# EAGLE design TPadTabletBattery (EAGLE 6.5.0)
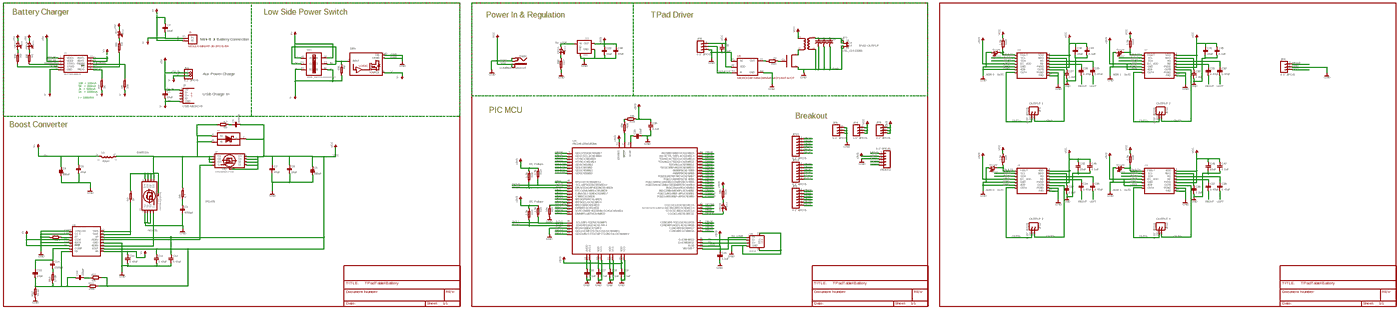
[diagram p0: schematic, sheet 1, overview]
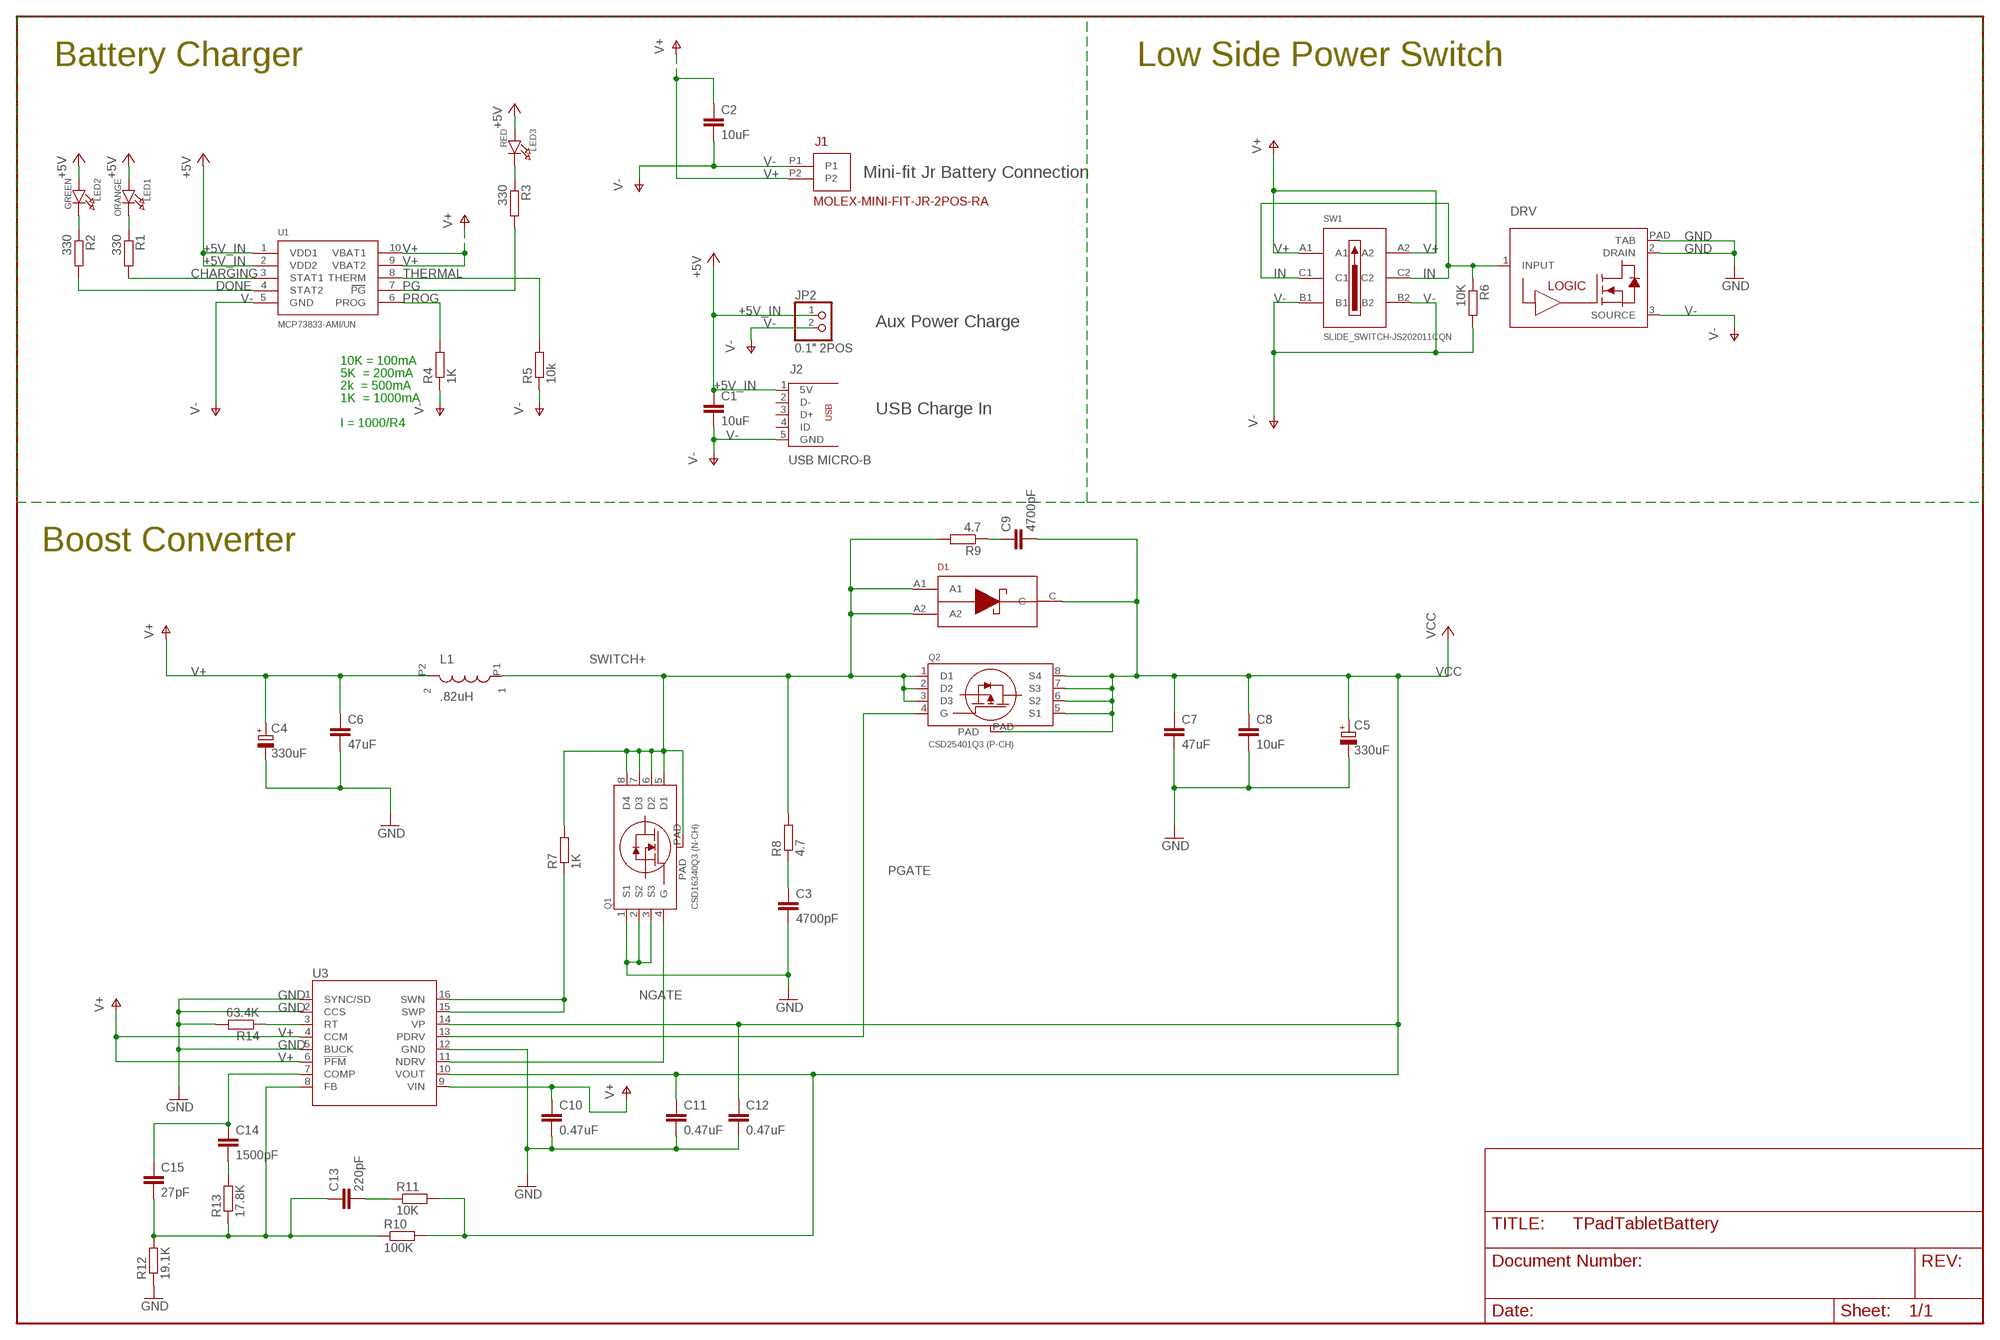
[diagram p1: schematic, sheet 1, part 1 of 4]
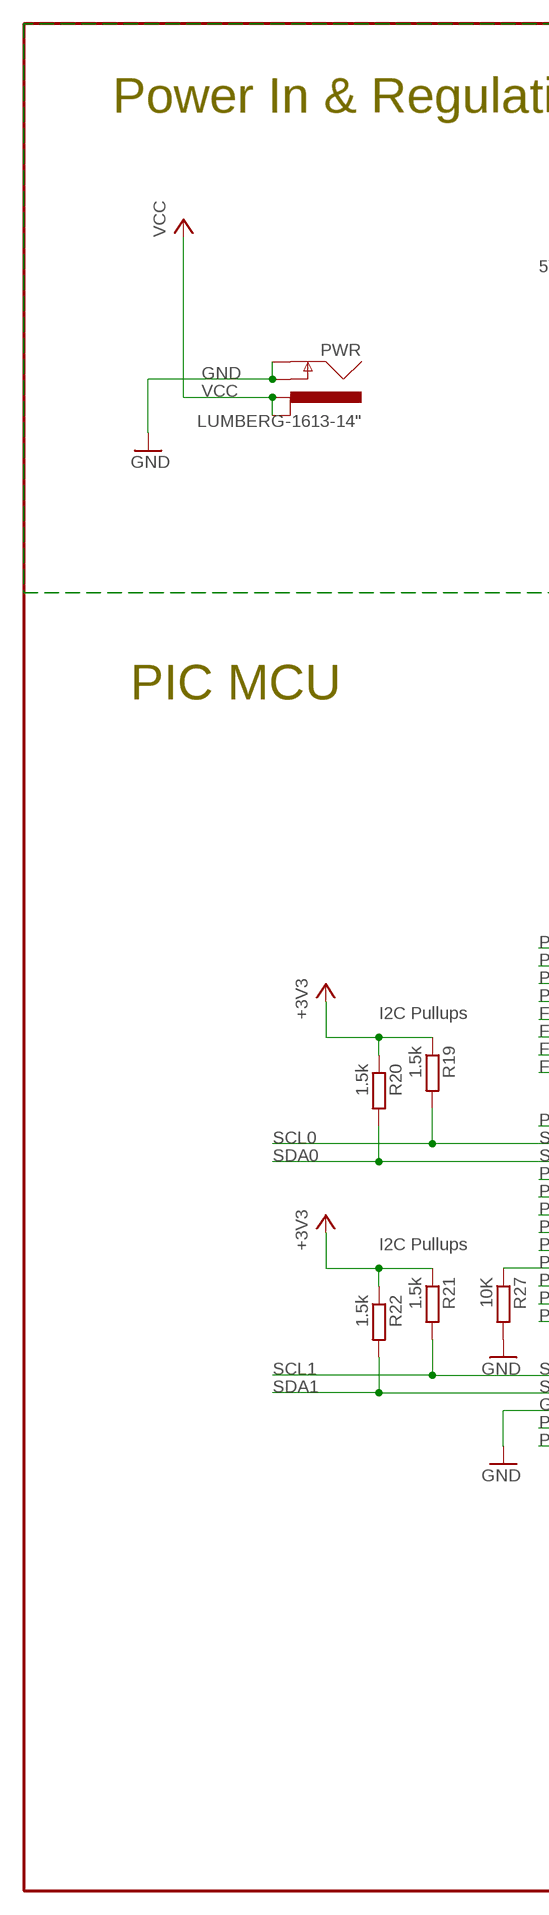
[diagram p2: schematic, sheet 1, part 2 of 4]
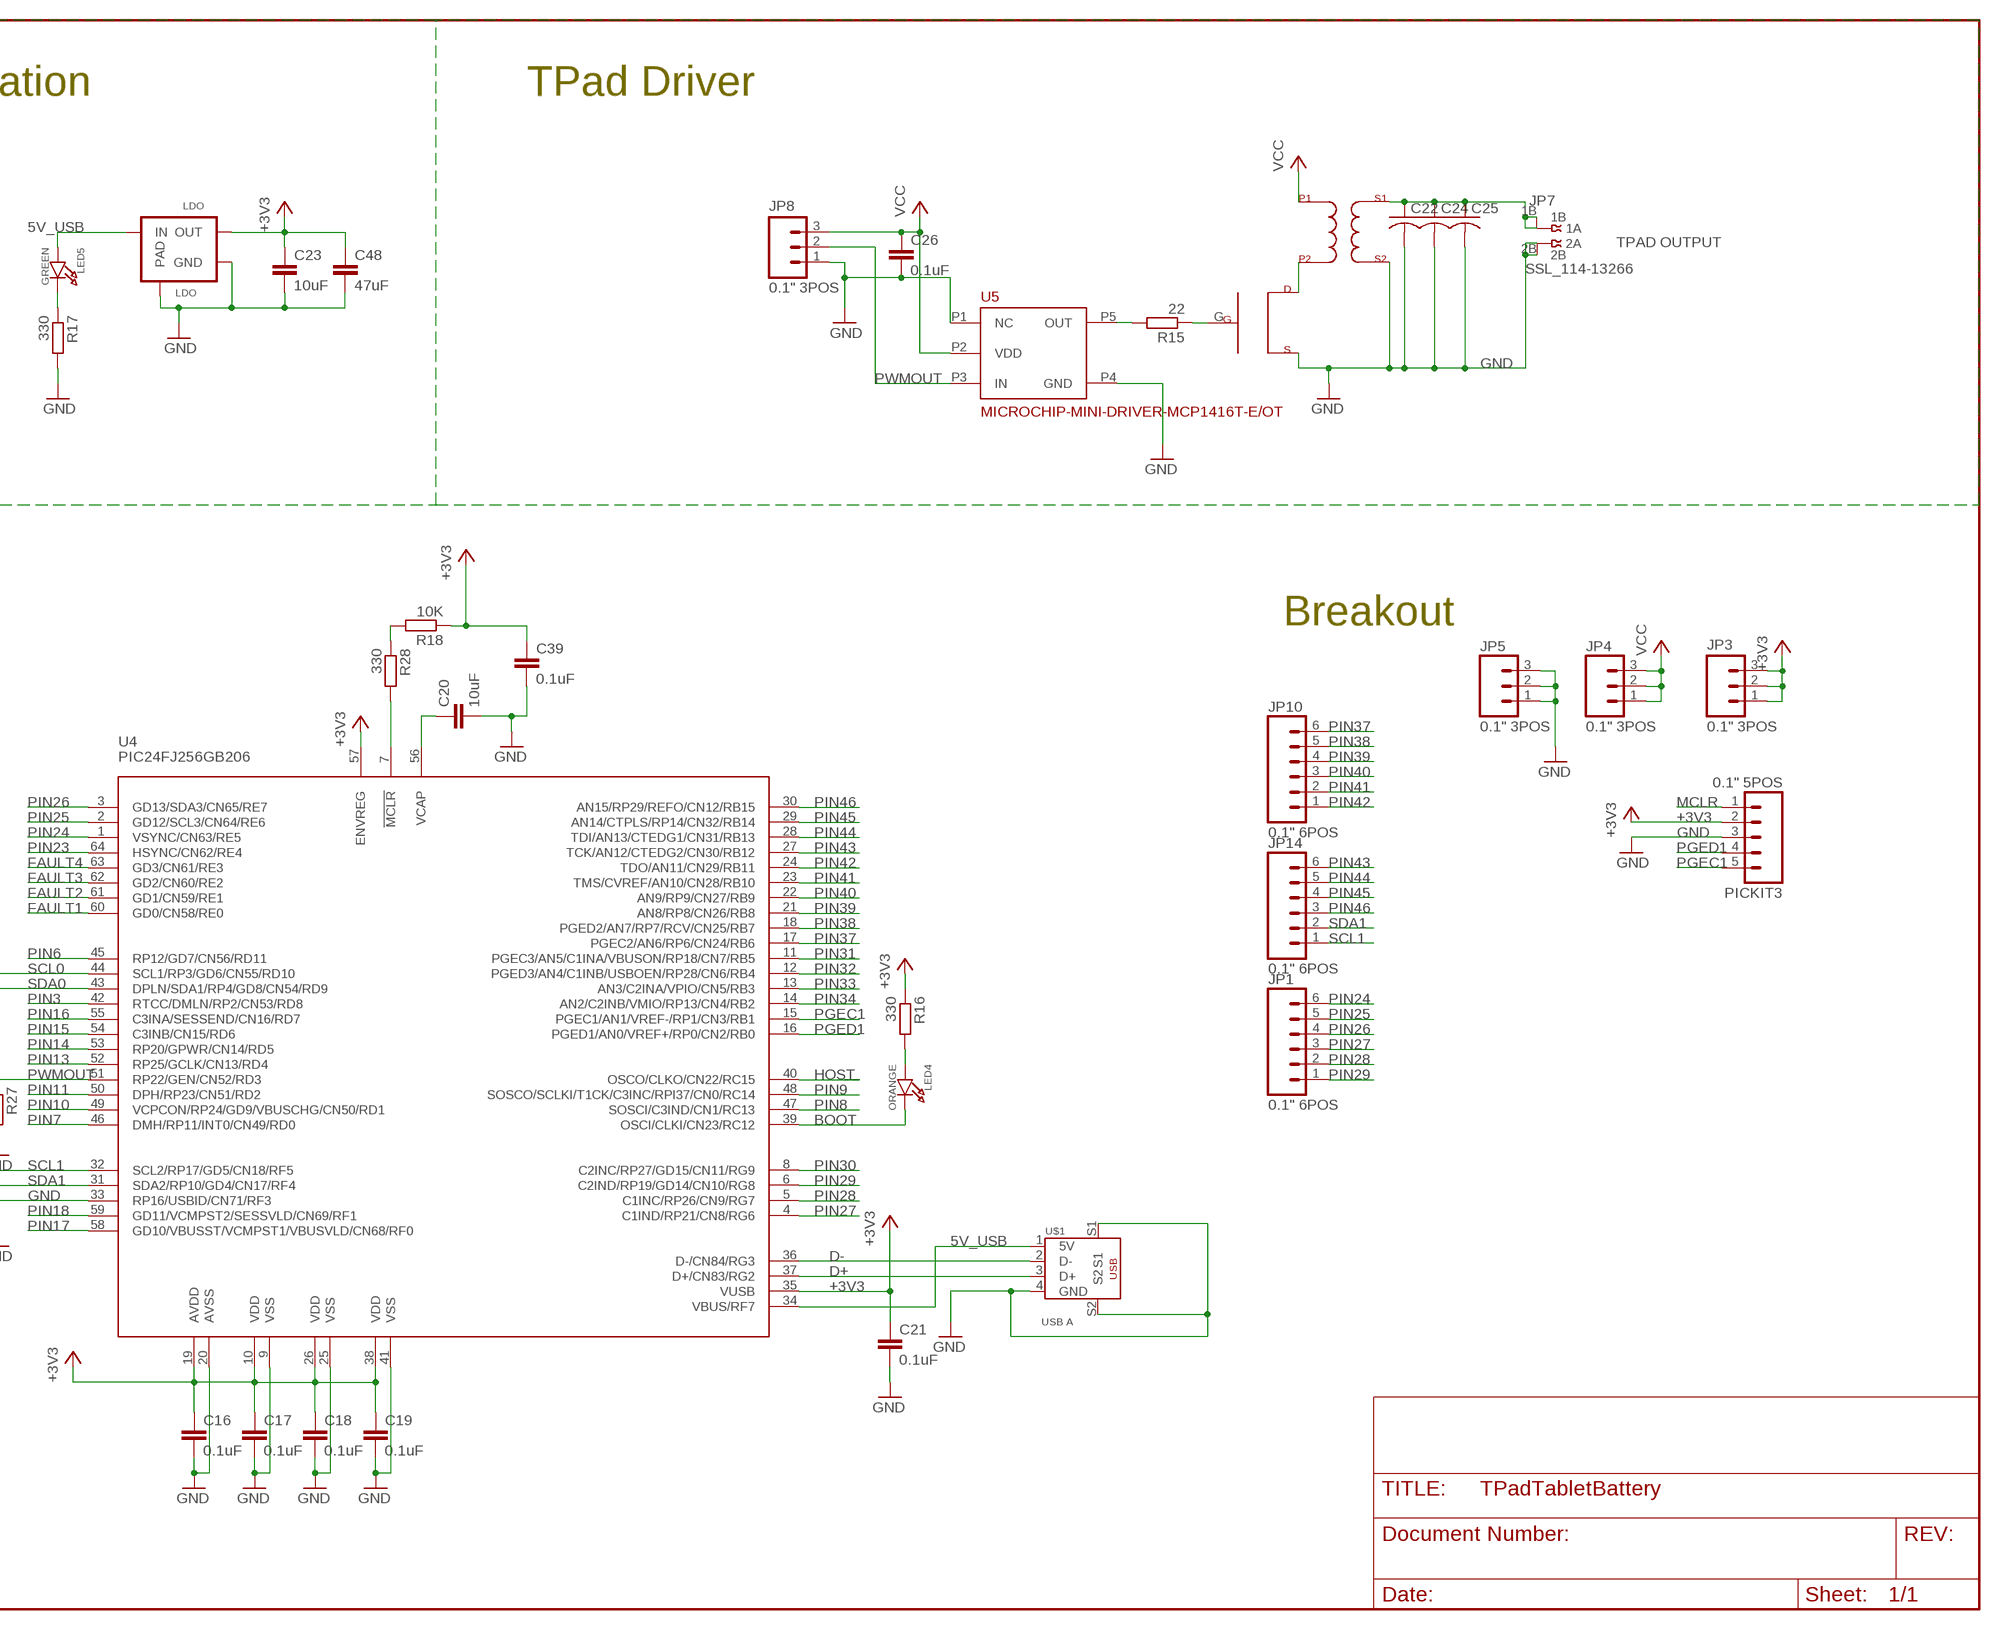
[diagram p3: schematic, sheet 1, part 3 of 4]
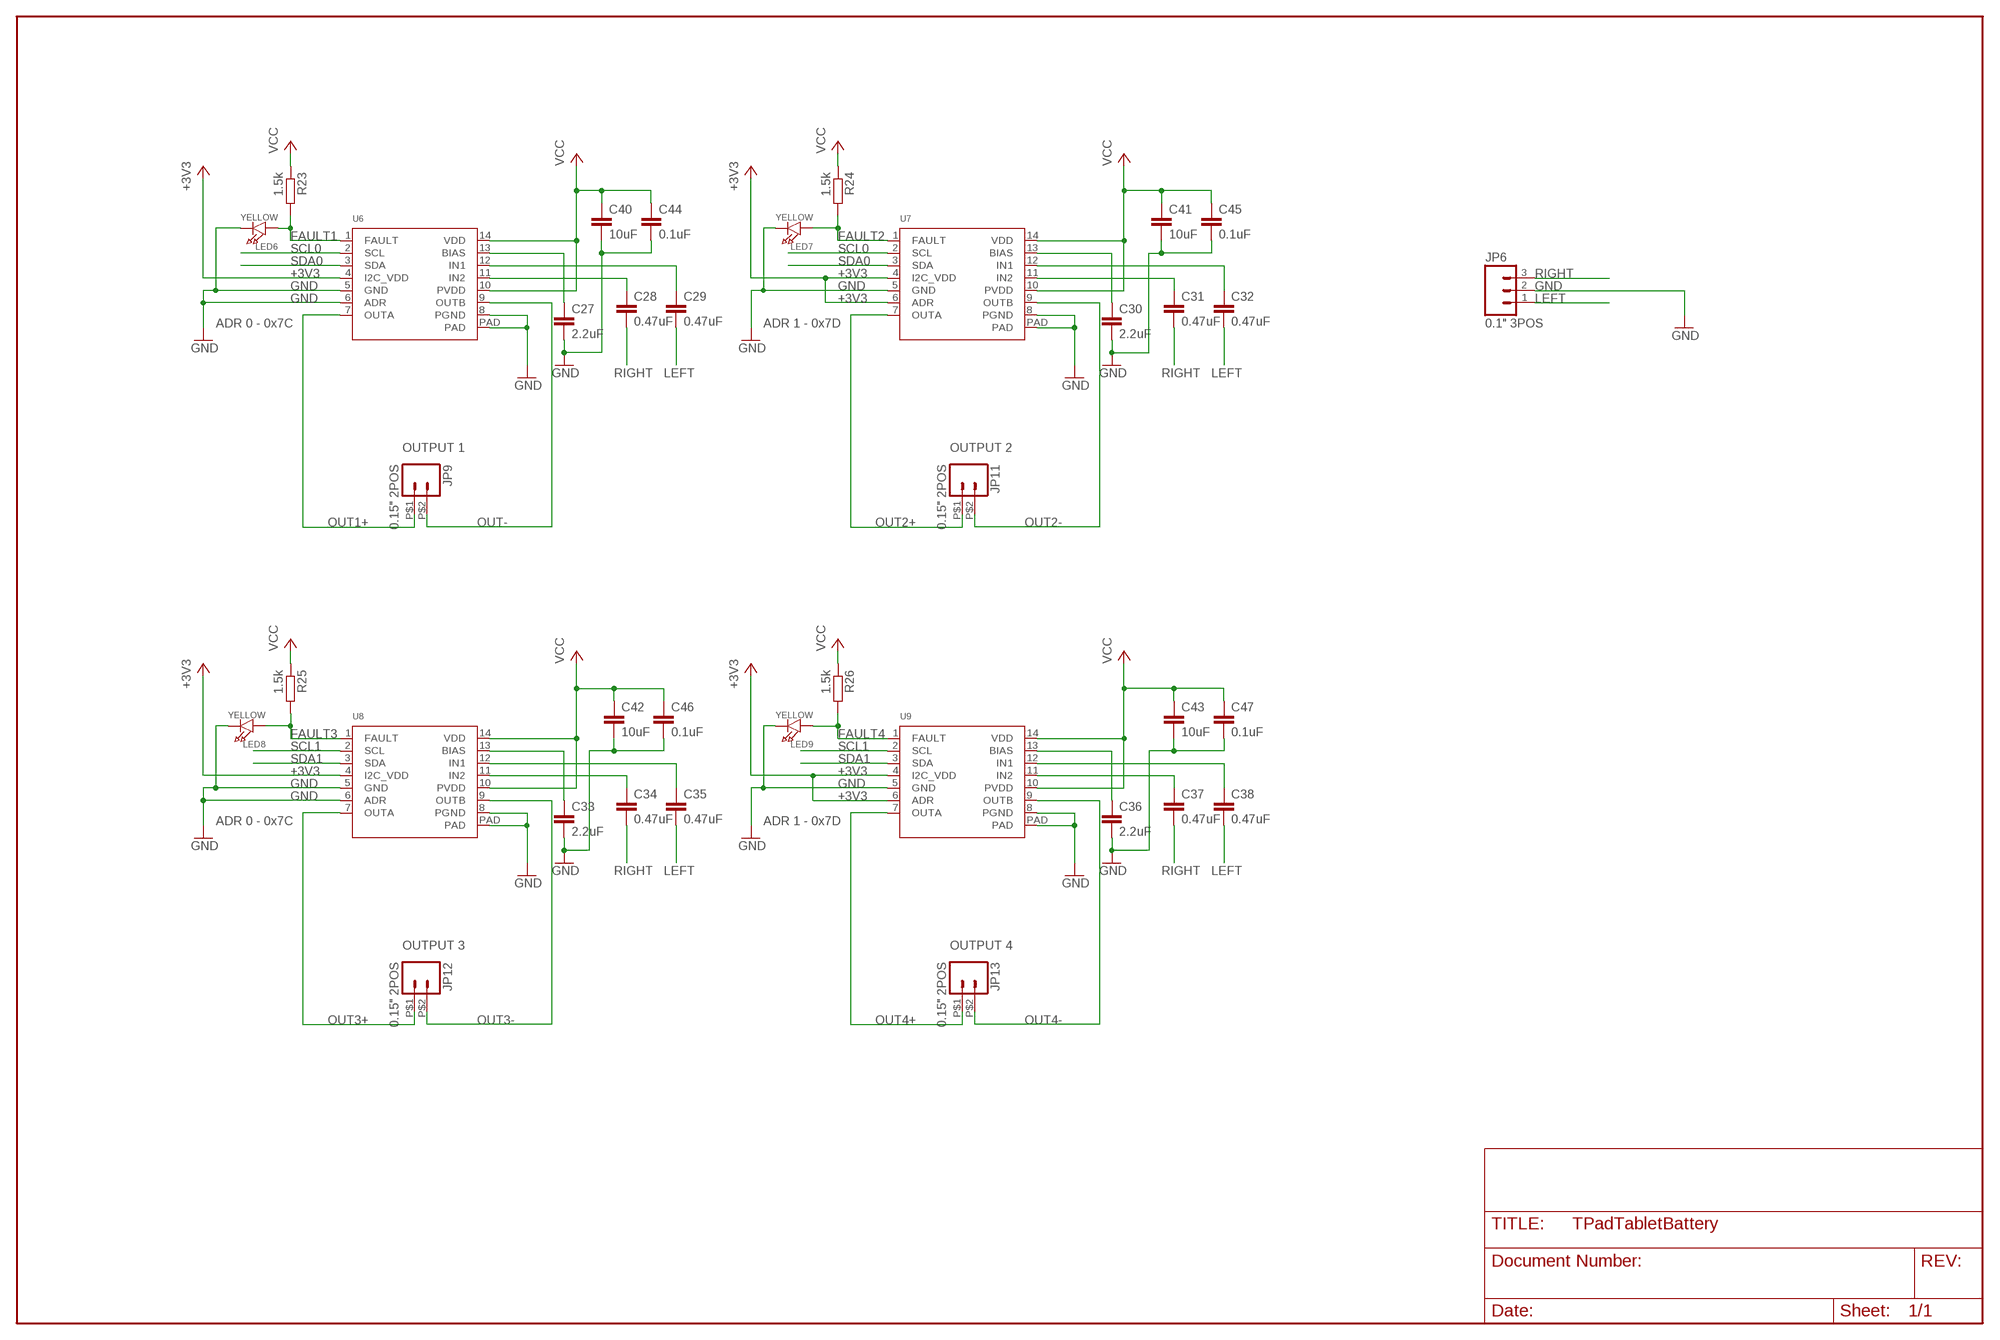
[diagram p4: schematic, sheet 1, part 4 of 4]

## Parts
C1  10uF  C-EUC0805  [C0805]
C2  10uF  C-EUC0805  [C0805]
C3  4700pF  C-EUC0603  [C0603]
C4  330uF  CPOL-EUC/6032-28R  [C/6032-28R]
C5  330uF  CPOL-EUC/6032-28R  [C/6032-28R]
C6  47uF  C-EUC1210  [C1210]
C7  47uF  C-EUC1210  [C1210]
C8  10uF  C-EUC0805  [C0805]
C9  4700pF  C-EUC0603  [C0603]
C10  0.47uF  C-EUC0603  [C0603]
C11  0.47uF  C-EUC0603  [C0603]
C12  0.47uF  C-EUC0603  [C0603]
C13  220pF  C-EUC0603  [C0603]
C14  1500pF  C-EUC0603  [C0603]
C15  27pF  C-EUC0603  [C0603]
C16  0.1uF  C-EUC0603  [C0603]
C17  0.1uF  C-EUC0603  [C0603]
C18  0.1uF  C-EUC0603  [C0603]
C19  0.1uF  C-EUC0603  [C0603]
C20  10uF  C-EUC0805  [C0805]
C21  0.1uF  C-EUC0603  [C0603]
C22  C-US050-035X075  [C050-035X075]
C23  10uF  C-EUC0805  [C0805]
C24  C-US050-035X075  [C050-035X075]
C25  C-US050-035X075  [C050-035X075]
C26  0.1uF  C-EUC0603  [C0603]
C27  2.2uF  C-EUC0603  [C0603]
C28  0.47uF  C-EUC0603  [C0603]
C29  0.47uF  C-EUC0603  [C0603]
C30  2.2uF  C-EUC0603  [C0603]
C31  0.47uF  C-EUC0603  [C0603]
C32  0.47uF  C-EUC0603  [C0603]
C33  2.2uF  C-EUC0603  [C0603]
C34  0.47uF  C-EUC0603  [C0603]
C35  0.47uF  C-EUC0603  [C0603]
C36  2.2uF  C-EUC0603  [C0603]
C37  0.47uF  C-EUC0603  [C0603]
C38  0.47uF  C-EUC0603  [C0603]
C39  0.1uF  C-EUC0603  [C0603]
C40  10uF  C-EUC0805  [C0805]
C41  10uF  C-EUC0805  [C0805]
C42  10uF  C-EUC0805  [C0805]
C43  10uF  C-EUC0805  [C0805]
C44  0.1uF  C-EUC0603  [C0603]
C45  0.1uF  C-EUC0603  [C0603]
C46  0.1uF  C-EUC0603  [C0603]
C47  0.1uF  C-EUC0603  [C0603]
C48  47uF  C-EUC1210  [C1210]
D1  POWER-DIODE_PDS835L  [POWER-DIODE_PDS835L]
DRV  VLN5050  [SOT-223]
J1  MOLEX-MINI-FIT-JR-2POS-RA  [MOLEX-MINI-FIT-JR-2POS-RA]
J2  USB MICRO-B  USB_MICROAMPHENOL_10118193-0001LFMICRO-B  [USB-MICROB_SMD]
JP1  0.1" 6POS  M06SIP  [1X06]
JP2  0.1" 2POS  MICROBUILDER_HEADER-1X2ROUND  [MICROBUILDER_1X02_ROUND]
JP3  0.1" 3POS  M03PTH  [1X03]
JP4  0.1" 3POS  M03PTH  [1X03]
JP5  0.1" 3POS  M03PTH  [1X03]
JP6  0.1" 3POS  M03PTH  [1X03]
JP7  SSL_114-13266  [SSL_114-13266]
JP8  0.1" 3POS  M03PTH  [1X03]
JP9  0.15" 2POS  M02PTH2  [1X02_BIG]
JP10  0.1" 6POS  M06SIP  [1X06]
JP11  0.15" 2POS  M02PTH2  [1X02_BIG]
JP12  0.15" 2POS  M02PTH2  [1X02_BIG]
JP13  0.15" 2POS  M02PTH2  [1X02_BIG]
JP14  0.1" 6POS  M06SIP  [1X06]
L1  .82uH  .82UH_INDUCTOR-IHLP3232DZERR82M01  [.82UH_INDUCTOR-IHLP3232DZERR82M01]
LDO  LDO  [SOT-223]
LED1  ORANGE  MICROBUILDER_LED0603  [MICROBUILDER_CHIPLED_0603]
LED2  GREEN  MICROBUILDER_LED0603  [MICROBUILDER_CHIPLED_0603]
LED3  RED  MICROBUILDER_LED0603  [MICROBUILDER_CHIPLED_0603]
LED4  ORANGE  MICROBUILDER_LED0603  [MICROBUILDER_CHIPLED_0603]
LED5  GREEN  MICROBUILDER_LED0603  [MICROBUILDER_CHIPLED_0603]
LED6  YELLOW  MICROBUILDER_LED0603  [MICROBUILDER_CHIPLED_0603]
LED7  YELLOW  MICROBUILDER_LED0603  [MICROBUILDER_CHIPLED_0603]
LED8  YELLOW  MICROBUILDER_LED0603  [MICROBUILDER_CHIPLED_0603]
LED9  YELLOW  MICROBUILDER_LED0603  [MICROBUILDER_CHIPLED_0603]
PICKIT3  0.1" 5POS  M05PTH  [1X05]
PWR  LUMBERG-1613-14"  [LUMBERG-1613_14]
Q1  CSD16340Q3  [CSDXXXXQ3]
Q2  CSD25401Q3  [CSDXXXXQ3]
Q3  STP27N3LH5  TPAD_IRF520N  [TPAD_TO220]
R1  330  R-EU_R0603  [R0603]
R2  330  R-EU_R0603  [R0603]
R3  330  R-EU_R0603  [R0603]
R4  1K  R-EU_R0805  [R0805]
R5  10k  R-EU_R0805  [R0805]
R6  10K  R-EU_R0603  [R0603]
R7  1K  R-EU_R0603  [R0603]
R8  4.7  R-EU_R0603  [R0603]
R9  4.7  R-EU_R0603  [R0603]
R10  100K  R-EU_R0603  [R0603]
R11  10K  R-EU_R0603  [R0603]
R12  19.1K  R-EU_R0603  [R0603]
R13  17.8K  R-EU_R0603  [R0603]
R14  63.4K  R-EU_R0603  [R0603]
R15  22  R-EU_R0603  [R0603]
R16  330  R-EU_R0603  [R0603]
R17  330  R-EU_R0603  [R0603]
R18  10K  R-EU_R0603  [R0603]
R19  1.5k  R-EU_R0603  [R0603]
R20  1.5k  R-EU_R0603  [R0603]
R21  1.5k  R-EU_R0603  [R0603]
R22  1.5k  R-EU_R0603  [R0603]
R23  1.5k  R-EU_R0603  [R0603]
R24  1.5k  R-EU_R0603  [R0603]
R25  1.5k  R-EU_R0603  [R0603]
R26  1.5k  R-EU_R0603  [R0603]
R27  10K  R-EU_R0603  [R0603]
R28  330  R-EU_R0603  [R0603]
SW1  SLIDE_SWITCH-JS202011CQN  [SLIDE_SWITCH-JS202011CQN]
U1  MCP73833-AMI/UN  MICROBUILDER_MCP73833  [MICROBUILDER_MSOP10]
U3  TPS43000  [TSSOP16]
U4  PIC24FJ256GB206  PIC24FXXXDAX06  [PIC24FXXX_TQFP64]
U5  MICROCHIP-MINI-DRIVER-MCP1416T-E/OT  [MICROCHIP-MINI-DRIVER-MCP1416T-E/OT]
U6  LM48100Q  [LM48100]
U7  LM48100Q  [LM48100]
U8  LM48100Q  [LM48100]
U9  LM48100Q  [LM48100]
U$1  USB A  USBSOCKET-THT  [USB-A_SOCKET-THT]
U$4  TRANSFORMER  [TRANSFORMER]

## Nets
5V_USB: LDO.1(IN) LED5.A U4.34(VBUS/RF7) U$1.1(5V)
+3V3: C16.1 C17.1 C18.1 C19.1 C21.1 C23.1 C39.1 C48.1 JP3.1 JP3.2 JP3.3 LDO.3(OUT) PICKIT3.2 R16.1 R18.1 R19.1 R20.1 R21.1 R22.1 U4.10(VDD) U4.19(AVDD) U4.26(VDD) U4.35(VUSB) U4.38(VDD) U4.57(ENVREG) U6.4(I2C_VDD) U7.4(I2C_VDD) U7.6(ADR) U8.4(I2C_VDD) U9.4(I2C_VDD) U9.6(ADR)
+5V_IN: C1.1 J2.1(5V) JP2.1 LED1.A LED2.A LED3.A U1.1(VDD1) U1.2(VDD2) ; supply symbol labelled +5V
BOOT: LED4.C U4.39(OSCI/CLKI/CN23/RC12)
CHARGING: R1.2 U1.3(STAT1)
D+: U4.37(D+/CN83/RG2) U$1.3(D+)
D-: U4.36(D-/CN84/RG3) U$1.2(D-)
DONE: R2.2 U1.4(STAT2)
FAULT1: LED6.A R23.2 U4.60(GD0/CN58/RE0) U6.1(FAULT)
FAULT2: LED7.A R24.2 U4.61(GD1/CN59/RE1) U7.1(FAULT)
FAULT3: LED8.A R25.2 U4.62(GD2/CN60/RE2) U8.1(FAULT)
FAULT4: LED9.A R26.2 U4.63(GD3/CN61/RE3) U9.1(FAULT)
GND: C3.2 C4.- C5.- C6.2 C7.2 C8.2 C10.2 C11.2 C12.2 C16.2 C17.2 C18.2 C19.2 C20.2 C21.2 C22.2 C23.2 C24.2 C25.2 C26.2 C27.2 C30.2 C33.2 C36.2 C39.2 C40.2 C41.2 C42.2 C43.2 C44.2 C45.2 C46.2 C47.2 C48.2 DRV.2(DRAIN) DRV.PAD(TAB) JP5.1 JP5.2 JP5.3 JP6.2 JP7.2A JP7.2B JP8.1 LDO.2(GND) LDO.PAD LED6.C LED7.C LED8.C LED9.C PICKIT3.3 PWR.1(GND) PWR.2(GND_INS) Q1.1(S1) Q1.2(S2) Q1.3(S3) Q3.S R12.1 R14.2 R17.2 R27.2 U3.1(SYNC/SD) U3.2(CCS) U3.5(BUCK) U3.12(GND) U4.9(VSS) U4.20(AVSS) U4.25(VSS) U4.33(RP16/USBID/CN71/RF3) U4.41(VSS) U5.P1(NC) U5.P4(GND) U6.5(GND) U6.6(ADR) U6.8(PGND) U6.PAD U7.5(GND) U7.8(PGND) U7.PAD U8.5(GND) U8.6(ADR) U8.8(PGND) U8.PAD U9.5(GND) U9.8(PGND) U9.PAD U$1.4(GND) U$1.S1 U$1.S2 U$4.S2
HOST: U4.40(OSCO/CLKO/CN22/RC15)
IN: DRV.1(INPUT) R6.1 SW1.C1 SW1.C2
LEFT: C29.2 C32.2 C35.2 C38.2 JP6.1
MCLR: PICKIT3.1 R18.2 R28.1
N$2: R7.1 U3.15(SWP) U3.16(SWN)
N$3: LED2.C R2.1
N$4: LED1.C R1.1
N$5: LED3.C R3.1
N$6: R28.2 U4.7(!MCLR)
N$7: C9.1 R9.1
N$8: C13.1 C15.2 R10.1 R12.2 R13.1 U3.8(FB)
N$11: C14.1 C15.1 U3.7(COMP)
N$12: C3.1 R8.1
N$13: C20.1 U4.56(VCAP)
N$14: R14.1 U3.3(RT)
N$15: C14.2 R13.2
N$16: LED4.A R16.2
N$17: C13.2 R11.1
N$18: Q3.D U$4.P2
N$19: R15.2 U5.P5(OUT)
N$20: C22.1 C24.1 C25.1 JP7.1A JP7.1B U$4.S1
N$21: LED5.C R17.1
N$23: Q3.G R15.1
N$24: C27.1 U6.13(BIAS)
N$25: C29.1 U6.12(IN1)
N$26: C28.1 U6.11(IN2)
N$27: C30.1 U7.13(BIAS)
N$28: C32.1 U7.12(IN1)
N$29: C31.1 U7.11(IN2)
N$30: C33.1 U8.13(BIAS)
N$31: C35.1 U8.12(IN1)
N$32: C34.1 U8.11(IN2)
N$33: C36.1 U9.13(BIAS)
N$34: C38.1 U9.12(IN1)
N$35: C37.1 U9.11(IN2)
NGATE: Q1.4(G) U3.11(NDRV)
OUT1+: JP9.P$1 U6.7(OUTA)
OUT2+: JP11.P$1 U7.7(OUTA)
OUT2-: JP11.P$2 U7.9(OUTB)
OUT3+: JP12.P$1 U8.7(OUTA)
OUT3-: JP12.P$2 U8.9(OUTB)
OUT4+: JP13.P$1 U9.7(OUTA)
OUT4-: JP13.P$2 U9.9(OUTB)
OUT-: JP9.P$2 U6.9(OUTB)
PG: R3.2 U1.7(PG)
PGATE: Q2.4(G) U3.13(PDRV)
PGEC1: PICKIT3.5 U4.15(PGEC1/AN1/VREF-/RP1/CN3/RB1)
PGED1: PICKIT3.4 U4.16(PGED1/AN0/VREF+/RP0/CN2/RB0)
PIN3: U4.42(RTCC/DMLN/RP2/CN53/RD8)
PIN6: U4.45(RP12/GD7/CN56/RD11)
PIN7: U4.46(DMH/RP11/INT0/CN49/RD0)
PIN8: U4.47(SOSCI/C3IND/CN1/RC13)
PIN9: U4.48(SOSCO/SCLKI/T1CK/C3INC/RPI37/CN0/RC14)
PIN10: U4.49(VCPCON/RP24/GD9/VBUSCHG/CN50/RD1)
PIN11: U4.50(DPH/RP23/CN51/RD2)
PIN13: U4.52(RP25/GCLK/CN13/RD4)
PIN14: U4.53(RP20/GPWR/CN14/RD5)
PIN15: U4.54(C3INB/CN15/RD6)
PIN16: U4.55(C3INA/SESSEND/CN16/RD7)
PIN17: U4.58(GD10/VBUSST/VCMPST1/VBUSVLD/CN68/RF0)
PIN18: U4.59(GD11/VCMPST2/SESSVLD/CN69/RF1)
PIN23: U4.64(HSYNC/CN62/RE4)
PIN24: JP1.6 U4.1(VSYNC/CN63/RE5)
PIN25: JP1.5 U4.2(GD12/SCL3/CN64/RE6)
PIN26: JP1.4 U4.3(GD13/SDA3/CN65/RE7)
PIN27: JP1.3 U4.4(C1IND/RP21/CN8/RG6)
PIN28: JP1.2 U4.5(C1INC/RP26/CN9/RG7)
PIN29: JP1.1 U4.6(C2IND/RP19/GD14/CN10/RG8)
PIN30: U4.8(C2INC/RP27/GD15/CN11/RG9)
PIN31: U4.11(PGEC3/AN5/C1INA/VBUSON/RP18/CN7/RB5)
PIN32: U4.12(PGED3/AN4/C1INB/USBOEN/RP28/CN6/RB4)
PIN33: U4.13(AN3/C2INA/VPIO/CN5/RB3)
PIN34: U4.14(AN2/C2INB/VMIO/RP13/CN4/RB2)
PIN37: JP10.6 U4.17(PGEC2/AN6/RP6/CN24/RB6)
PIN38: JP10.5 U4.18(PGED2/AN7/RP7/RCV/CN25/RB7)
PIN39: JP10.4 U4.21(AN8/RP8/CN26/RB8)
PIN40: JP10.3 U4.22(AN9/RP9/CN27/RB9)
PIN41: JP10.2 U4.23(TMS/CVREF/AN10/CN28/RB10)
PIN42: JP10.1 U4.24(TDO/AN11/CN29/RB11)
PIN43: JP14.6 U4.27(TCK/AN12/CTEDG2/CN30/RB12)
PIN44: JP14.5 U4.28(TDI/AN13/CTEDG1/CN31/RB13)
PIN45: JP14.4 U4.29(AN14/CTPLS/RP14/CN32/RB14)
PIN46: JP14.3 U4.30(AN15/RP29/REFO/CN12/RB15)
PROG: R4.2 U1.6(PROG)
PWMOUT: JP8.2 R27.1 U4.51(RP22/GEN/CN52/RD3) U5.P3(IN)
RIGHT: C28.2 C31.2 C34.2 C37.2 JP6.3
SCL0: R19.2 U4.44(SCL1/RP3/GD6/CN55/RD10) U6.2(SCL) U7.2(SCL)
SCL1: JP14.1 R21.2 U4.32(SCL2/RP17/GD5/CN18/RF5) U8.2(SCL) U9.2(SCL)
SDA0: R20.2 U4.43(DPLN/SDA1/RP4/GD8/CN54/RD9) U6.3(SDA) U7.3(SDA)
SDA1: JP14.2 R22.2 U4.31(SDA2/RP10/GD4/CN17/RF4) U8.3(SDA) U9.3(SDA)
SWITCH+: D1.A1 D1.A2 L1.P1 Q1.5(D1) Q1.6(D2) Q1.7(D3) Q1.8(D4) Q1.PAD Q2.1(D1) Q2.2(D2) Q2.3(D3) R7.2 R8.2 R9.2
THERMAL: R5.2 U1.8(THERM)
V+: C2.1 C4.+ C6.1 C10.1 J1.P2 L1.P2 SW1.A1 SW1.A2 U1.9(VBAT2) U1.10(VBAT1) U3.4(CCM) U3.6(!PFM) U3.9(VIN)
V-: C1.2 C2.2 DRV.3(SOURCE) J1.P1 J2.5(GND) JP2.2 R4.1 R5.1 R6.2 SW1.B1 SW1.B2 U1.5(GND)
VCC: C5.+ C7.1 C8.1 C9.2 C11.1 C12.1 C26.1 C40.1 C41.1 C42.1 C43.1 C44.1 C45.1 C46.1 C47.1 D1.C JP4.1 JP4.2 JP4.3 JP8.3 PWR.3(PWR_1) PWR.4(PWR_2) Q2.5(S1) Q2.6(S2) Q2.7(S3) Q2.8(S4) Q2.PAD R10.2 R11.2 R23.1 R24.1 R25.1 R26.1 U3.10(VOUT) U3.14(VP) U5.P2(VDD) U6.10(PVDD) U6.14(VDD) U7.10(PVDD) U7.14(VDD) U8.10(PVDD) U8.14(VDD) U9.10(PVDD) U9.14(VDD) U$4.P1
Unconnected: J2.2(D-) J2.3(D+) J2.4(ID)

## Notes on the sheet
- Battery Charger | Low Side Power Switch
- Power In & Regulation | TPad Driver
- Mini-fit Jr Battery Connection
- TPAD OUTPUT
- Aux Power Charge | ADR 0 - 0x7C | ADR 1 - 0x7D
- 10K = 100mA
- 5K  = 200mA
- 2k  = 500mA
- 1K  = 1000mA
- USB Charge In
- I = 1000/R4
- OUTPUT 1 | OUTPUT 2
- PIC MCU
- Breakout
- Boost Converter
- I2C Pullups
- ADR 0 - 0x7C | ADR 1 - 0x7D
- I2C Pullups
- OUTPUT 3 | OUTPUT 4

## Library data of the parts
C1-C3 C6-C21 C23 C26-C48 = rcl:C-EU: CAPACITOR, European symbol
C4 C5 = rcl:CPOL-EU: POLARIZED CAPACITOR, European symbol
C22 C24 C25 = rcl:C-US: CAPACITOR, American symbol
D1 = Craig:POWER-DIODE_PDS835L
DRV = ICST:VLN5050
J1 = Craig:MOLEX-MINI-FIT-JR-2POS-RA
J2 = ICST:USB_MICRO
JP1 JP10 JP14 = SparkFun-Connectors:M06: Header 6 Standard 6-pin 0.1" header. Use with straight break away headers (SKU : PRT-00116), right angle break away headers (PRT-00553), swiss pins (PRT-00743), machine pins (PRT-00117), and female headers (PRT-00115). Molex polarized connector foot print use with SKU : PRT-08094 with associated crimp pins and housings. NOTES ON THE VARIANTS LOCK and LOCK_LONGPADS... This footprint was designed to help hold the alignment of a through-hole component (i.e. 6-pin header) while soldering it into place. You may notice that each hole has been shifted either up or down by 0.005 of an inch from it's more standard position (which is a perfectly straight line). This slight alteration caused the pins (the squares in the middle) to touch the edges of the holes. Because they are alternating, it causes a "brace" to hold the component in place. 0.005 has proven to be the perfect amount of "off-center" position when using our standard breakaway headers. Although looks a little odd when you look at the bare footprint, once you have a header in there, the alteration is very hard to notice. Also, if you push a header all the way into place, it is covered up entirely on the bottom side. This idea of altering the position of holes to aid alignment will be further integrated into the Sparkfun Library for other footprints. It can help hold any component with 3 or more connection pins.
JP2 = MCP73833_QFN_v1.0:MICROBUILDER_HEADER-1X2: PIN HEADER
JP3-JP6 JP8 = SparkFun:M03: Header 3 Standard 3-pin 0.1" header. Use with straight break away headers (SKU : PRT-00116), right angle break away headers (PRT-00553), swiss pins (PRT-00743), machine pins (PRT-00117), and female headers (PRT-00115). Molex polarized connector foot print use with SKU : PRT-08232 with associated crimp pins and housings.
JP7 = ICST:SSL_114-13266
JP9 JP11-JP13 = SparkFun-Connectors:M02: Header 2 Standard 2-pin 0.1" header. Use with straight break away headers (SKU : PRT-00116), right angle break away headers (PRT-00553), swiss pins (PRT-00743), machine pins (PRT-00117), and female headers (PRT-00115). Molex polarized connector foot print use with SKU : PRT-08233 with associated crimp pins and housings.
L1 = Craig:.82UH_INDUCTOR-IHLP3232DZERR82M01
LDO = ICST:LDO
LED1-LED9 = MCP73833_QFN_v1.0:MICROBUILDER_LED: LED 0603 - 0603 Surface Mount Package 2mA: Green LED - Low Power (3.9mcd, 2ma, 1.7Vf) - Digikey: 475-2709-2-ND Orange LED - Low Power (9.8mcd, 2ma, 1.8Vf) - Digikey: 475-1194-2-ND Red LED - Low Power (5mcd, 2ma, 1.8Vf) - Digikey: 475-1195-2-ND Yellow LED - Low Power (7mcd, 2ma, 1.8Vf) - Digikey: 475-1196-2-ND 5mA: Blue LED - Low Power (17mcd, 5ma, 2.9Vf) - Digikey: LNJ937W8CRACT-ND 0805 - 0805 Surface Mount Package 2mA: Red LED (8.8mcd, 2mA, 1.8Vf, Clear) - Low Power [Digikey: 475-2510-1-ND] Green LED (5mcd, 2mA, 1.8Vf, Clear) - Low Power [Digikey: 475-2730-1-ND] Yellow LED (11.3mcd, 2mA, 1.8Vf, Clear) - Low Power [Digikey: 475-2555-1-ND] 20mA: Red LED (104mcd, 20mA, Diffused) - LS R976 [Digikey: 475-1278-6-ND] Red LED (12mcd, 20mA, 2.0Vf, Clear) - APT2012EC [Digikey: 754-1128-1-ND] Green LED (15mcd, 20mA, 2.2Vf, Clear) - APT2012GC [Digikey: 754-1131-1-ND] Orange LED (160mcd, 20mA, 2.1Vf, Clear) - APT2012SECK [Digikey: 754-1130-1-ND] 1206 - 1206 Surface Mount Package Green LED (26mcd, 20mA, Diffused) - LG N971 [Digikey: 475-1407-6-ND] Red LED (15mcd, 20mA, Diffused) - LH N974 [Digikey: 475-1416-6-ND]
PICKIT3 = SparkFun:M05: Header 5 Standard 5-pin 0.1" header. Use with straight break away headers (SKU : PRT-00116), right angle break away headers (PRT-00553), swiss pins (PRT-00743), machine pins (PRT-00117), and female headers (PRT-00115). Molex polarized connector foot print use with SKU : PRT-08230 with associated crimp pins and housings.
PWR = SABRe:LUMBERG-1613-14
Q1 = ICST:CSD16340Q3
Q2 = ICST:CSD25401Q3
Q3 = TPaD_Tablet_v1:TPAD_IRF520N
R1-R28 = rcl:R-EU_: RESISTOR, European symbol
SW1 = Craig:SLIDE_SWITCH-JS202011CQN
U1 = MCP73833_QFN_v1.0:MICROBUILDER_MCP73833: Lithium-Polymer/Lithium-Ion Battery Charger [Part No.] Microchip MCP73833 MSOP10 (tube only): Digikey: MCP73833T-AMI/UN or MCP73833-FCI/UN-ND Mouser: 579-MCP73833-AMI/UN DFN10 (tape): Digikey: Note Chips ending in AMI' have no timer, and chips ending in FCI have a 6-hour timer that will end the charge sequence after 6 horus regqrdless of current charge level. '
U3 = ICST:TPS43000
U4 = SparkFun-DigitalIC:PIC24FXXXDAX06: PIC24FXXXDAX06 PIC24FXXXDA106 / PIC24FXXXDA206
U5 = Craig:MICROCHIP-MINI-DRIVER-MCP1416T-E/OT
U6-U9 = ICST:LM48100Q
U$1 = ICST:USB
U$4 = TPaD:TRANSFORMER

## Board
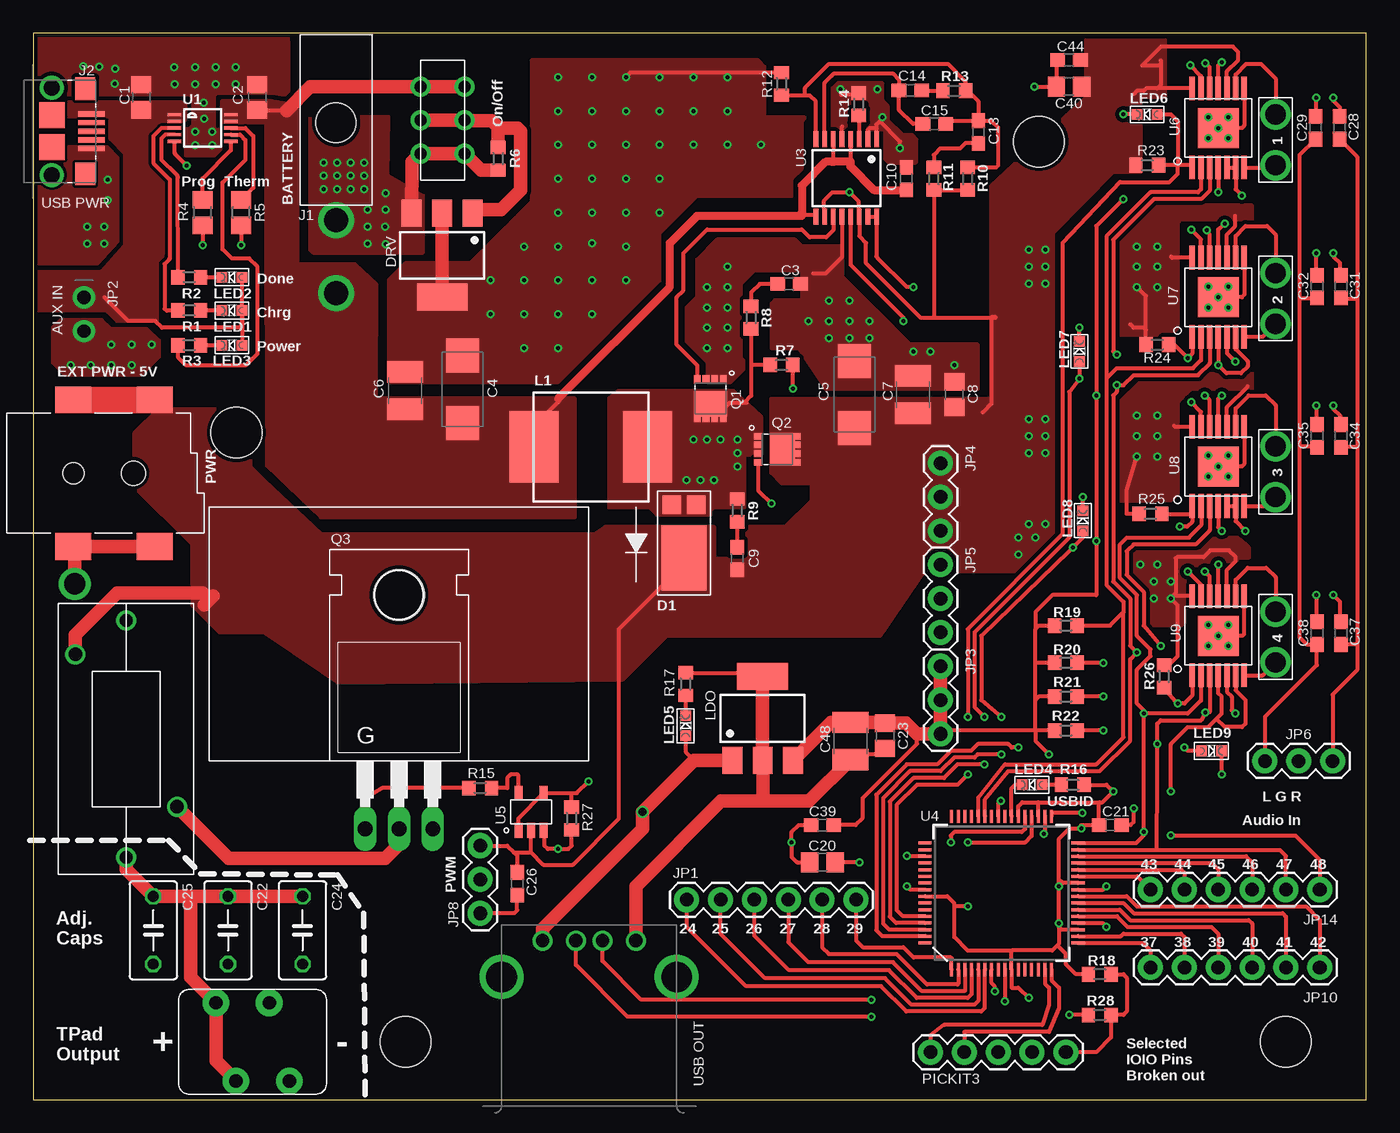
[diagram p5: board, top side]
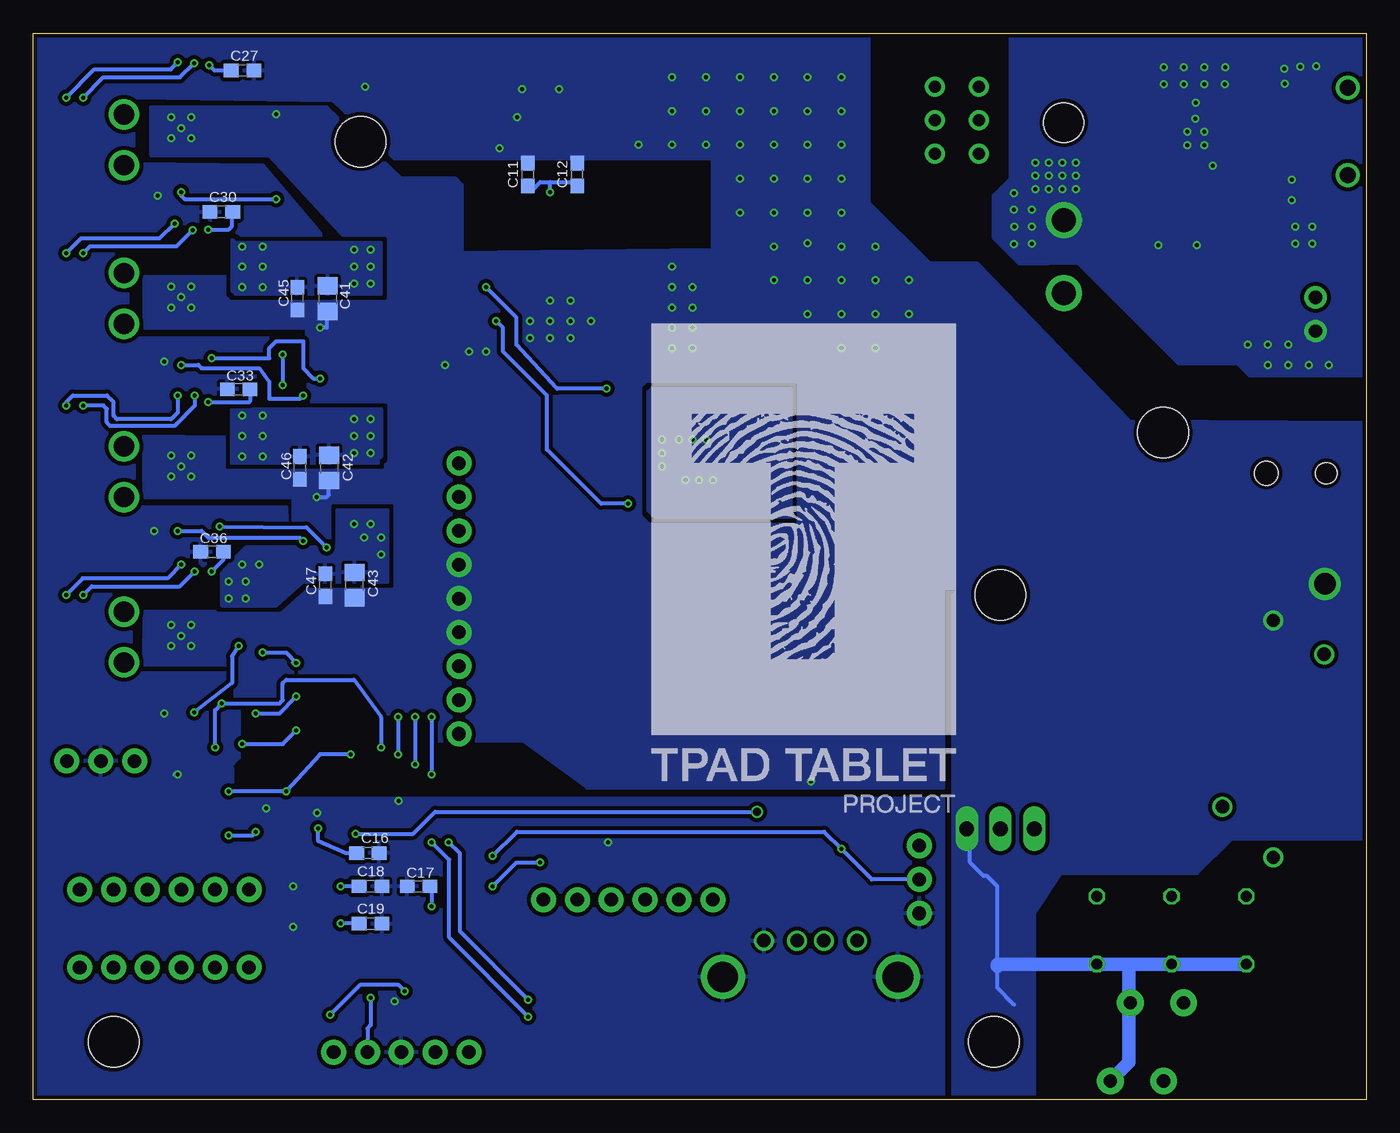
[diagram p6: board, bottom side, seen from below]

Size 100 x 80 mm. Coordinates in mm from the lower left corner, seen from the top.
Outline: 0,0 100,0 100,80 0,80 0,0
Copper layers (1*16): Top 0.035mm / dielectric 0.5mm / Bottom 0.035mm
Design rules "2L-0.5mm-0.15_0.3mm": minimum track width 0.15mm, minimum drill 0.3mm, track to track 0.15mm, track to pad 0.15mm, pad to pad 0.15mm, via to via 0.15mm, smd to smd 0.15mm, copper to edge 0.3mm, drill to drill 0.5mm, minimum pad ring 0.15mm, minimum via ring 0.15mm, stop-mask expansion 0.1mm, vias tented up to drill 0.8mm, thermal gap 0.25mm
Holes 3.81 mm at 93.98,4.32 75.44,71.88 27.94,4.32 15.24,50.04

### Footprints (pad centres in the part's own frame; a part is rotated, then mirrored left to right if it is on the bottom)
C0805 = smd 1.3 x 1.5: 1 -0.95,0; 2 0.95,0
C0603 = smd 1.1 x 1: 1 -0.85,0; 2 0.85,0
C/6032-28R = smd 2.55 x 2.5: + 2.525,0; - -2.525,0
C1210 = smd 1.6 x 2.7: 1 -1.4,0; 2 1.4,0
C050-035X075 = drill 0.813 octagon: 1 -2.54,0; 2 2.54,0
POWER-DIODE_PDS835L = smd 1.39 x 1.4: A1 -0.92,-3.98; A2 0.92,-3.98 | smd 3.36 x 4.86: C 0,0
SOT-223 = smd 1.499 x 2.007: 1 -2.261,-3.15; 2 0.025,-3.15; 3 2.311,-3.15 | smd 3.81 x 2.007: PAD 0,3.15
MOLEX-MINI-FIT-JR-2POS-RA = drill 1.8: P1 0,0; P2 0,5.5 | hole 3: 0,-7.3
USB-MICROB_SMD = smd 0.4 x 2: 1 -1.3,2.975; 2 -0.65,2.975; 3 0,2.975; 4 0.65,2.975; 5 1.29,2.975 | drill 1.2 pad 1.7: P$10 -3.275,0; P$11 3.275,0 | smd 1.7 x 1.5: PAD1 -3.2,2.5; PAD2 3.2,2.5 | smd 1.9 x 1.9: PAD3 -1.2,0; PAD4 1.2,0
1X06 = drill 1.016 pad 1.88: 1 0,0; 2 2.54,0; 3 5.08,0; 4 7.62,0; 5 10.16,0; 6 12.7,0
MICROBUILDER_1X02_ROUND = drill 1 pad 1.676: 1 -1.27,0; 2 1.27,0
1X03 = drill 1.016 pad 1.88: 1 0,0; 2 2.54,0; 3 5.08,0
SSL_114-13266 = drill 1 pad 2: 1A -4,0; 1B -5.5,5.86; 2A 0,0; 2B -1.5,5.86
1X02_BIG = drill 1.524: P$1 0,0; P$2 3.81,0
.82UH_INDUCTOR-IHLP3232DZERR82M01 = smd 3.683 x 5.334: P1 -4.242,0; P2 4.267,0
MICROBUILDER_CHIPLED_0603 = smd 0.8 x 0.8: A 0,-0.75; C 0,0.75
1X05 = drill 1.016 pad 1.88: 1 0,0; 2 2.54,0; 3 5.08,0; 4 7.62,0; 5 10.16,0
LUMBERG-1613_14 = smd 2 x 2.7: 1 5.5,5; 2 5.5,11.1; 3 -5.5,11.1; 4 -5.5,5 | hole 1.6: 0,5 | hole 1.8: 0,9.5
CSDXXXXQ3 = smd 0.5 x 0.63: 1 -0.97,-1.43; 2 -0.32,-1.43; 3 0.33,-1.43; 4 0.98,-1.43; 5 0.98,1.44; 6 0.33,1.44; 7 -0.32,1.44; 8 -0.97,1.44 | smd 2.45 x 1.9: PAD 0,0.41
TPAD_TO220 = drill 1.118 long: D 0,-5.08; G -2.54,-5.08; S 2.54,-5.08 | hole 3.81: 0,12.446
R0603 = smd 1 x 1.1: 1 -0.85,0; 2 0.85,0
R0805 = smd 1.3 x 1.5: 1 -0.95,0; 2 0.95,0
SLIDE_SWITCH-JS202011CQN = drill 0.9 pad 1.5: A1 2.5,3.3; A2 2.5,0; B1 -2.5,3.3; B2 -2.5,0; C1 0,3.3; C2 0,0
MICROBUILDER_MSOP10 = smd 0.25 x 1: 1 -1,-2.113; 2 -0.5,-2.113; 3 0,-2.113; 4 0.5,-2.113; 5 1,-2.113; 6 1,2.113; 7 0.5,2.113; 8 0,2.113; 9 -0.5,2.113; 10 -1,2.113
TSSOP16 = smd 0.35 x 1.2: 1 -2.275,-2.9; 2 -1.625,-2.9; 3 -0.975,-2.9; 4 -0.325,-2.9; 5 0.325,-2.9; 6 0.975,-2.9; 7 1.625,-2.9; 8 2.275,-2.9; 9 2.275,2.9; 10 1.625,2.9; 11 0.975,2.9; 12 0.325,2.9; 13 -0.325,2.9; 14 -0.975,2.9; 15 -1.625,2.9; 16 -2.275,2.9
PIC24FXXX_TQFP64 = smd 0.22 x 1: 1 -3.75,-5.75; 2 -3.25,-5.75; 3 -2.75,-5.75; 4 -2.25,-5.75; 5 -1.75,-5.75; 6 -1.25,-5.75; 7 -0.75,-5.75; 8 -0.25,-5.75; 9 0.25,-5.75; 10 0.75,-5.75; 11 1.25,-5.75; 12 1.75,-5.75; 13 2.25,-5.75; 14 2.75,-5.75; 15 3.25,-5.75; 16 3.75,-5.75; 33 3.75,5.75; 34 3.25,5.75; 35 2.75,5.75; 36 2.25,5.75; 37 1.75,5.75; 38 1.25,5.75; 39 0.75,5.75; 40 0.25,5.75; 41 -0.25,5.75; 42 -0.75,5.75; 43 -1.25,5.75; 44 -1.75,5.75; 45 -2.25,5.75; 46 -2.75,5.75; 47 -3.25,5.75; 48 -3.75,5.75 | smd 1 x 0.22: 17 5.75,-3.75; 18 5.75,-3.25; 19 5.75,-2.75; 20 5.75,-2.25; 21 5.75,-1.75; 22 5.75,-1.25; 23 5.75,-0.75; 24 5.75,-0.25; 25 5.75,0.25; 26 5.75,0.75; 27 5.75,1.25; 28 5.75,1.75; 29 5.75,2.25; 30 5.75,2.75; 31 5.75,3.25; 32 5.75,3.75; 49 -5.75,3.75; 50 -5.75,3.25; 51 -5.75,2.75; 52 -5.75,2.25; 53 -5.75,1.75; 54 -5.75,1.25; 55 -5.75,0.75; 56 -5.75,0.25; 57 -5.75,-0.25; 58 -5.75,-0.75; 59 -5.75,-1.25; 60 -5.75,-1.75; 61 -5.75,-2.25; 62 -5.75,-2.75; 63 -5.75,-3.25; 64 -5.75,-3.75
MICROCHIP-MINI-DRIVER-MCP1416T-E/OT = smd 0.6 x 1.1: P1 -0.95,-1.4; P2 0,-1.4; P3 0.95,-1.4; P4 0.95,1.4; P5 -0.95,1.4
LM48100 = smd 0.42 x 1.78: 1 -1.95,-2.97; 2 -1.3,-2.97; 3 -0.65,-2.97; 4 0,-2.97; 5 0.65,-2.97; 6 1.3,-2.97; 7 1.95,-2.97; 8 1.95,2.97; 9 1.3,2.97; 10 0.65,2.97; 11 0,2.97; 12 -0.65,2.97; 13 -1.3,2.97; 14 -1.95,2.97 | smd 3.1 x 3: PAD 0,0
USB-A_SOCKET-THT = drill 1: 1 -3.5,2.72; 2 -1,2.72; 3 1,2.72; 4 3.5,2.72 | drill 2.3: S1 -6.57,0; S2 6.57,0
TRANSFORMER = drill 1: P1 16.51,3.81; P2 5.08,-3.81; S1 1.27,0; S2 19.05,0

### Placement (x,y rotation side)
C1  8.1,75.2 90 top
C2  16.8,75.2 90 top
C3  56.7,61.2 0 top
C4  32.2,53.3 270 top
C5  61.6,52.9 270 top
C6  27.9,53.2 90 top
C7  66,52.9 90 top
C8  69.1,52.9 90 top
C9  52.8,40.6 270 top
C10  65.5,69.1 90 top
C11  62.9,69.4 90 bottom
C12  59.2,69.4 90 bottom
C13  70.9,72.6 270 top
C14  65.8,75.7 0 top
C15  67.6,73.2 0 top
C16  74.9,18.5 0 bottom
C17  71.1,16 180 bottom
C18  74.7,16 0 bottom
C19  74.7,13.2 0 bottom
C20  59.2,17.8 180 top
C21  80.8,20.6 0 top
C22  14.6,12.7 270 top
C23  63.9,27.3 270 top
C24  20.2,12.7 270 top
C25  9,12.7 270 top
C26  36.3,16.2 270 top
C27  84.3,77.2 0 bottom
C28  98,72.9 270 top
C29  96.2,72.9 270 top
C30  85.9,66.6 180 bottom
C31  98.1,61 270 top
C32  96.3,61 270 top
C33  84.6,53.3 180 bottom
C34  98.1,49.8 270 top
C35  96.3,49.8 270 top
C36  86.6,41.1 180 bottom
C37  98.1,35 270 top
C38  96.3,35 270 top
C39  59.2,20.6 180 top
C40  77.7,76 180 top
C41  77.9,60.1 270 bottom
C42  77.8,47.4 270 bottom
C43  75.9,38.6 270 bottom
C44  77.7,78 180 top
C45  80.2,60.1 270 bottom
C46  80,47.4 270 bottom
C47  78.1,38.6 270 bottom
C48  61.3,26.9 270 top
D1  48.82,40.64 180 top
DRV  30.68,63.35 180 top
J1  22.7,66 180 top
J2  1.4,72.64 270 top
JP1  49.02,14.99 0 top
JP2  3.81,58.93 270 top
JP3  68.07,32.51 270 top
JP4  68.07,47.75 270 top
JP5  68.07,40.13 270 top
JP6  92.4,25.4 0 top
JP7  19.2,1.4 0 top
JP8  33.53,13.97 90 top
JP9  93.2,70.1 90 top
JP10  96.52,9.91 180 top
JP11  93.2,58.2 90 top
JP12  93.2,45.2 90 top
JP13  93.2,32.8 90 top
JP14  96.52,15.75 180 top
L1  41.83,48.97 180 top
LDO  54.7,28.6 0 top
LED1  14.9,59.2 90 top
LED2  14.9,61.7 90 top
LED3  14.9,56.6 90 top
LED4  74.93,23.62 90 top
LED5  48.94,28.04 0 top
LED6  83.57,73.91 90 top
LED7  78.49,56.13 0 top
LED8  78.74,43.43 0 top
LED9  88.39,26.16 270 top
LOGO  [TPADTABLETPROJECT]  53.64,21.16 0 bottom
PICKIT3  77.47,3.56 180 top
PWR  -2,47 270 top
Q1  50.8,52.6 180 top
Q2  55.8,48.8 270 top
Q3  27.43,25.4 0 top
R1  11.7,59.2 180 top
R2  11.7,61.7 180 top
R3  11.7,56.6 180 top
R4  12.7,66.55 90 top
R5  15.6,66.55 90 top
R6  34.87,70.59 270 top
R7  56.13,55.12 180 top
R8  53.85,58.67 270 top
R9  52.8,44.2 90 top
R10  70.1,69.09 270 top
R11  67.56,69.09 270 top
R12  56.13,76.2 270 top
R13  69.09,75.69 180 top
R14  61.93,74.68 90 top
R15  33.53,23.37 0 top
R16  77.98,23.62 180 top
R17  48.94,31.17 90 top
R18  80.01,9.4 0 top
R19  77.47,35.56 0 top
R20  77.47,32.77 0 top
R21  77.47,30.23 0 top
R22  77.47,27.69 0 top
R23  83.57,70.1 0 top
R24  84.33,56.64 0 top
R25  83.82,43.94 0 top
R26  84.84,31.75 270 top
R27  40.39,21.08 90 top
R28  80.01,6.35 180 top
SW1  32.36,73.48 90 top
U1  12.7,72.9 270 top
U3  60.99,69.14 180 top
U4  72.64,15.49 0 top
U5  37.34,21.59 0 top
U6  88.9,72.9 0 top
U7  88.9,60.2 0 top
U8  88.9,47.5 0 top
U9  88.9,34.8 0 top
U$1  41.7,9.2 0 top
U$4  6.97,16.89 90 top

### Tracks (layer width: path | path; a pad name or v marks a point on that pad's centre or on a via)
5V_USB  (via drill 0.3, 0.6)
  Top 0.3: U4.34 75.89,20.01 v75.82,19.94 | LED5.A 48.94,26.09 49.58,25.45
  Top 1: U$1.1 38.2,12.8 45.72,20.32 v45.72,21.59 49.58,25.45 LDO.1
  Bottom 0.3: v75.82,19.94 71.5,19.94 69.85,21.59 v45.72,21.59
+3V3  (via drill 0.3)
  Top 0.3: 75.18,27.69 68.33,27.69 JP3.3 | R22.1 75.18,27.69 | 75.18,27.69 75.18,29.97 | 75.18,29.97 75.18,32.77 | 75.18,32.77 75.18,35.31 | 75.18,35.31 75.44,35.56 R19.1 | R20.1 75.18,32.77 | R21.1 76.62,30.39 | 76.62,30.39 76.71,30.48 | 76.62,30.39 76.45,30.23 75.44,30.23 75.18,29.97 | v81.79,67.56 79.76,65.53 v79.76,52.83 v79.76,41.91 79.76,37.85 76.45,37.85 75.18,36.58 75.18,35.31 | 75.18,27.69 75.18,26.92 v76.2,25.91 | v85.34,23.11 85.34,26.67 86.61,27.94 88.14,27.94 88.77,28.57 | 88.77,28.57 89.15,28.96 89.15,30.23 88.9,30.48 U9.4 | U9.6 90.2,30.7 90.93,29.97 90.93,28.19 90.68,27.94 89.41,27.94 88.77,28.57 | v74.68,7.62 73.9,8.39 73.39,8.39 U4.10 73.39,11.16 | U4.26 77.23,16.24 76.96,16.51 | U4.19 77.17,12.74 76.96,12.95 | 76.96,12.95 v76.96,13.21 v76.96,16 76.96,16.51 | 73.39,11.16 73.41,11.18 76.45,11.18 76.83,11.56 | U4.57 68.58,15.24 69.09,14.73 69.09,14.48 | 76.96,12.95 76.96,11.68 76.83,11.56 | 73.39,11.16 70.12,11.16 69.09,12.19 69.09,14.48 | v70.1,14.48 69.09,14.48 | R16.1 80.52,23.62 v81.03,23.11 80.21,22.3 80,22.3 | 76.96,16.51 76.96,19.56 77.75,20.34 v78.61,20.34 78.61,20.57 78.64,20.6 C21.1 79.95,22.25 80,22.3 | R18.1 78.23,9.4 77.47,10.16 77.47,10.92 76.83,11.56 | C39.1 61.7,20.6 62.23,21.13 62.23,22.63 66.29,26.69 66.29,27.43 | 63.85,28.3 C23.1 | U6.4 v88.9,68.07 | U7.4 v88.9,55.12 89.52,54.5 90.6,54.5 91.1,55 91.1,55.4 90.2,56.3 U7.6 | U8.4 88.9,42.93 v89.15,42.67 | U4.38 73.89,21.99 74.2,22.3 75.4,22.3 | 75.4,22.3 80,22.3 | U4.35 75.39,22.29 75.4,22.3
  Top 1: JP3.1 JP3.2 JP3.3 66.29,27.43 65.48,28.25 C23.1 63.85,28.3 C48.1 59.86,28.3 LDO.3
  Bottom 0.3: v88.9,68.07 88.9,67.82 88.65,67.56 v81.79,67.56 | v88.9,55.12 87.63,55.12 87.38,54.86 83.06,54.86 82.3,53.85 82.3,52.58 80.01,52.58 v79.76,52.83 | v76.2,25.91 78.49,25.91 v81.03,23.11 v85.34,23.11 | v89.15,42.67 87.38,42.67 86.87,42.16 80.01,42.16 v79.76,41.91 | v74.68,7.62 74.68,5.59 74.93,5.33 PICKIT3.2 | v78.61,20.34 78.61,19.41 76.56,18.5 C16.1 | C18.1 v76.96,16 | C19.1 v76.96,13.21 | C17.1 70.1,15.85 v70.1,14.48
+5V_IN
  Top 0.3: LED1.A LED2.A | LED1.A LED3.A | LED1.A 15.61,58.03 15.49,57.91 9.65,57.91 9.14,58.42 7.11,58.42 5.33,60.2
  pour Top (isolate 0.2, no thermals): -0.08,59.2 -0.13,62.13 5.13,62.13 6.91,64.11 6.91,70.97 5.79,72.09 5.79,73.71 5.74,73.76 0.13,73.76 -0.03,73.91 -0.03,74.83 11.3,74.83 11.4,74.73 11.4,73.53 11.28,73.41 9.5,73.41 8.59,72.49 8.59,69.9 9.7,68.78 9.7,63.45 9.68,63.42 9.68,63.27 9.27,62.87 9.27,58.42 9.3,58.39 6.3,58.39 5.49,59.2
BOOT
  Top 0.3: LED4.C 73.66,23.62 73.41,23.37 73.39,23.36 U4.39
CHARGING
  Top 0.3: R1.2 10.01,59.18 9.86,59.33 9.86,62.69 10.16,62.99 arc45 10.24,63.17 10.24,69.04 9,70.27 9,72.3 9.6,72.9 U1.3
D+  (via drill 0.3)
  Top 0.3: U4.37 74.39,20.29 74.17,20.07 69.09,20.07 68.83,19.81 v68.83,19.3 | v62.87,7.49 45.61,7.49 42.7,10.4 U$1.3
  Bottom 0.3: v62.87,7.49 68,12.63 68,18.47 v68.83,19.3
D-  (via drill 0.3)
  Top 0.3: U4.36 74.89,19.78 74.42,19.3 v70.1,19.3 | v62.87,6.22 44.58,6.22 40.7,10.1 U$1.2
  Bottom 0.3: v62.87,6.22 68.8,12.16 68.8,18 v70.1,19.3
DONE
  Top 0.3: R2.2 10.83,69.2 arc45 10.76,69.38 9.6,70.54 9.6,72.1 9.9,72.4 U1.4
FAULT1  (via drill 0.3)
  Top 0.3: v70.1,28.7 70.1,35.31 77.22,42.42 77.22,64.26 81.53,68.83 85.23,68.83 85.85,69.45 85.85,70.1 | 85.85,70.1 R23.2 | v70.1,24.38 69.34,23.62 66.29,23.62 64.77,22.1 64.77,14.22 65.25,13.74 U4.60 | LED6.A 85.34,73.91 85.85,73.41 85.85,70.1 | U6.1 86.95,70.1 85.85,70.1
  Bottom 0.3: v70.1,28.7 v70.1,24.38
FAULT2  (via drill 0.3)
  Top 0.3: U7.1 86.95,55.96 v86.61,55.63 85.6,56.64 R24.2 | v71.37,28.7 70.61,29.46 70.61,35.05 77.72,42.16 77.72,53.09 v78.49,54.1 LED7.A | v71.37,25.15 69.34,25.15 68.33,24.13 66.04,24.13 64.26,22.35 64.26,13.72 64.73,13.24 U4.61
  Bottom 0.3: v86.61,55.63 82.3,55.63 82.3,56.39 81.79,56.9 79.76,56.9 79.76,54.86 78.99,54.1 v78.49,54.1 | v71.37,28.7 v71.37,25.15
FAULT3  (via drill 0.3)
  Top 0.3: v72.64,28.7 71.12,29.97 71.12,34.8 77.72,41.15 v77.98,41.4 78.74,42.16 LED8.A | v72.64,25.91 70.87,25.91 70.61,25.65 69.09,25.65 68.07,24.64 65.79,24.64 63.75,22.61 63.75,13.21 64.22,12.74 U4.62 | R25.2 86.95,43.94 | 86.95,43.94 U8.1 | 86.95,43.94 86.95,43.35 86.58,42.98 v86,42.98
  Bottom 0.3: v86,42.98 79.5,42.93 v77.98,41.4 | v72.64,28.7 v72.64,25.91
FAULT4  (via drill 0.3)
  Top 0.3: U9.1 86.95,30.31 86.36,29.72 v85.85,29.72 85.69,29.88 R26.2 | v73.91,26.42 73.41,26.42 73.15,26.67 70.87,26.67 70.36,26.16 68.83,26.16 67.82,25.15 65.53,25.15 63.25,22.86 63.25,12.7 63.7,12.24 U4.63 | LED9.A 86.61,26.16 v86.36,26.42
  Bottom 0.3: v73.91,26.42 73.91,28.7 75.95,31.5 81.03,31.5 81.28,31.24 81.28,29.97 81.53,29.72 v85.85,29.72 86.36,29.21 v86.36,26.42
GND  (via drill 0.3, 1.6)
  Top 0.3: 58.51,61.98 59.44,61.98 60.66,63.2 U3.12 | v65.02,71.37 65.02,71.88 63.5,73.41 63.25,73.15 63.25,72.9 | 62.59,72.75 62.74,72.9 63.25,72.9 | 60.63,75.36 60.71,75.44 61.84,75.44 R14.2 | R12.1 44.79,77.05 v44.45,76.71 | U7.5 89.55,55.99 v90.17,55.37 | U9.5 89.55,30.59 89.92,30.23 89.92,29.21 v90.17,28.96 | U4.9 v72.89,7.36 v72.9,7.36 v72.9,7.37 | v82.55,21.84 82.55,20.83 82.32,20.6 C21.2 | U4.25 80.26,15.74 v80.52,16 | U4.20 80.23,13.24 v80.52,12.95 | JP8.1 36.07,13.97 36.3,14.2 C26.2 | U6.8 90.85,73.07 90.68,72.9 U6.PAD | U8.8 90.85,47.67 90.68,47.5 U8.PAD | U7.8 90.85,60.37 90.68,60.2 U7.PAD | U9.8 90.85,34.95 90.7,34.8 U9.PAD | LED9.C 89.14,24.4 v89.15,24.38 | LED8.C v78.74,45.21 | LED7.C v78.49,57.91 | LED6.C v81.79,73.91 | C39.2 57.43,20.6 56.9,20.07 v56.9,19.3 56.9,18.2 57.3,17.8 C20.2 | C44.2 76.75,78 C40.2 v75.1,76 | U5.P1 36.39,21.09 U5.P4 40.3,22.99 | 40.3,22.99 40.77,22.99 v41.66,23.88 | R27.2 40.39,22.9 40.3,22.99 | v90.68,67.82 90.2,68.3 U6.6 U6.5 | v90.93,42.67 90.2,43.4 U8.6 U8.5 | C23.2 63.45,25.9 61.8,25.9 61.4,25.5 C48.2 | R17.2 54.43,32.02 LDO.PAD | 62.59,72.75 62.65,72.75 62.8,72.9 | U3.1 63.26,72.88 63.25,72.9 | U3.5 60.66,72.96 60.7,73 | U3.2 62.61,72.72 62.59,72.75 | v78.7,21.5 76.39,21.5 U4.33 | U4.41 72.39,22.19 v72.6,22.4
  Top 1: DRV.PAD DRV.2 | U$1.4 45.2,15.99 51.61,22.4 54.8,22.4 | C48.2 58.2,22.4 54.8,22.4 | LDO.PAD 54.7,25.48 LDO.2 54.73,22.48 54.8,22.4 | PWR.2 PWR.1 3.1,41.5 v3.1,38.7
  Bottom 0.3: 26.42,7.11 27.69,8.38 27.69,10 27.69,16 28.45,16.76 28.7,16.76 29.72,17.78 29.72,20.07 Q3.S | v89.15,24.38 89.41,24.38 | v78.74,45.21 77.98,45.21 77.83,45.36 77.83,46.42 | 77.88,58.78 77.98,58.67 77.98,57.91 v78.49,57.91
  Bottom 1: C25.2 C22.2 17.8,10.16 | 17.8,10.16 C24.2 27.69,10.16 27.69,10 | 17.8,10.16 17.8,7.26 | 17.8,7.26 17.8,2.8 JP7.2A | 17.8,7.26 JP7.2B
  other vias: 39.37,76.71 39.37,74.17 39.37,71.63 39.37,69.09 39.37,66.55 52.07,76.71 39.37,61.47 39.37,58.93 39.37,56.39 36.83,56.39 36.83,58.93 36.83,61.47 36.83,64.01 34.29,58.93 41.91,58.93 41.91,61.47 41.91,64.26 41.91,69.09 41.91,71.63 41.91,74.17 41.91,76.71 44.45,74.17 44.45,71.63 44.45,69.09 44.45,66.55 44.45,64.01 44.45,61.47 39.37,64.01 52.07,71.63 41.91,66.55 49.53,71.63 46.99,74.17 54.61,71.63 46.99,69.09 46.99,71.63 49.53,74.17 46.99,76.71 49.53,76.71 52.07,74.17 52.07,56.39 59.69,58.42 59.69,57.15 61.21,57.15 61.21,58.42 62.74,58.42 62.74,57.15 50.55,56.39 50.55,57.91 52.07,57.91 52.07,59.44 50.55,59.44 59.69,59.94 61.21,59.94 50.55,60.96 52.07,60.96 60.55,75.79 63.35,75.79 63.7,73.71 34.29,61.47 52.07,62.48 58.17,58.42 88.14,35.61 88.14,34.04 89.66,34.04 89.66,35.61 89.66,46.74 88.14,46.74 88.14,48.31 89.66,48.31 89.66,59.44 88.14,59.44 89.66,61.01 88.14,61.01 89.66,72.14 88.14,72.14 88.14,73.71 89.66,73.71 66.04,56.13 67.31,56.13 69.09,55.12 46.99,66.55 88.9,60.2 88.9,47.5 88.9,34.8 88.9,72.9
  pour Top (isolate 0.3, no thermals): 32.8,62.74 27.94,62.74 26.67,61.47 26.67,53.85 39.37,53.85 46.99,61.47 46.99,65.02 49.78,67.82 56.9,67.82 56.9,69.09 57.66,69.85 57.66,73.41 57.91,73.66 54.86,73.66 54.86,77.47 54.36,77.98 37.38,77.98 37.38,67.32
  pour Bottom (isolate 0.3, rank 3, no thermals): 37.34,80.01 37.34,67.31 32.77,62.74 29.21,62.74 17.78,50.9 0,50.8 0,38.1 31.75,38.35 31.75,23.37 58.42,23.37 63.25,26.92 71.12,26.92 71.63,63.5 49.02,63.75 49.02,70.61 72.9,70.61 77.47,74.93 77.47,80.26
  pour Top (no thermals): 57.66,61.98 57.66,57.66 58.93,56.39 58.93,55.63 59.69,54.86 62.23,54.86 63.25,53.85 65.28,53.85 65.79,54.36 65.79,56.64 63.25,59.18 62.23,59.18 59.44,61.98
  pour Top (isolate 0.3, no thermals): 60.71,64.01 57.66,64.01 57.15,64.52 51.31,64.52 49.78,62.99 49.78,60.2 49.02,59.44 49.02,56.9 50.59,55.32 50.59,53.85 52.32,53.85 53.59,55.12 53.09,55.63 53.09,61.21 54.1,62.23 59.44,62.23 59.44,60.71 58.67,59.94 55.63,59.94 55.37,59.69 55.37,56.39 57.4,56.39 59.44,53.34 70.87,53.34 70.87,56.64 65.79,56.64 60.71,61.72
  pour Top (isolate 0.3, no thermals): 59.94,72.9 61.21,72.9 61.21,74.83 60.96,75.08 62.59,75.08 62.79,74.88 62.79,73 62.59,72.8 63.8,72.8 63.91,72.69 63.91,70.61 64.21,70.31 66.19,70.31 66.24,70.36 66.24,72.03 65.94,72.34 65.23,72.34 64.11,73.46 64.11,74.52 63.7,74.93 63.7,76.25 60.35,76.25 59.94,75.84
  pour Bottom (isolate 0.3, rank 2): 77.47,74.93 92.46,75.18 92.53,70.23 82.8,70.1 78.49,65.02 78.23,62.23 92.96,62.48 92.96,57.15 78.49,57.15 78.49,50.04 92.46,50.29 92.46,44.45 81.03,44.45 80.77,37.08 92.71,37.08 92.71,32 84.58,32 84.58,25.65 85.34,24.89 99.31,24.89 99.82,25.15 99.82,80.01 77.47,80.01
  pour Bottom (isolate 0.3): 99.82,22.86 99.82,24.89 85.09,24.89 85.09,23.37 84.84,22.61 31.75,22.61 31.75,-0.76 99.82,-0.76 100.08,-0.51
  pour Bottom (isolate 0.3, rank 3, no thermals): 67.82,63.75 67.82,68.58 68.33,69.09 72.39,69.09 77.98,74.42 91.19,74.42 91.19,70.87 82.3,70.87 76.45,64.52 78.23,62.74 78.74,61.72 91.69,61.72 91.69,57.91 79.5,57.91 79.3,49.58 91.74,49.73 91.69,45.21 80.52,45.21 80.52,38.35 82.04,36.58 91.69,36.58 91.72,32.64 84.86,32.64 84.84,25.65 77.22,25.65 71.37,29.46 71.63,63.75 68.07,63.5
  pour Bottom (isolate 0.3, no thermals): 30.99,37.85 30.99,0.04 24.9,0 24.9,14 22.9,17 12.7,17 10.1,19.6 -0.08,19.6 0,37.85 -0.25,38.1 30.73,38.1
IN
  Top 0.3: 32.41,73.43 SW1.C2 | 33.03,66.75 DRV.1 | 34.92,72.9 34.87,72.95
  Top 1: R6.1 34.87,72.95 34.39,73.43 32.41,73.43 | 33.03,66.75 35.08,66.75 36.55,68.22 36.55,72.67 36.32,72.9 34.92,72.9 | SW1.C1 SW1.C2
LEFT
  Top 0.3: 95,60.1 95,70.85 C29.2 96.27,71.98 | 95,60.1 95,49 | 95,49 95,34.7 95.55,34.15 C38.2 | C32.2 96.27,60.12 96.27,60.1 95,60.1 | 96.27,48.92 C35.2 96.3,49 95,49 | 96.27,34.12 C38.2 | C38.2 96.3,32.6 92.4,28.7 JP6.1
MCLR
  Top 0.3: R18.2 81.79,9.4 82.04,9.14 82.04,6.6 81.79,6.35 R28.1 80.86,4.66 79.76,3.56 PICKIT3.1
N$2  (via drill 0.3)
  Top 0.3: v66.04,60.96 65.53,60.96 63.35,63.15 63.26,63.23 | 63.26,63.23 63.25,63.25 | v57,53.34 57,55.1 R7.1 | U3.15 U3.16 63.26,63.23
  Bottom 0.3: v57,53.34 60.71,53.34 63.75,56.64 63.75,58.67 v66.04,60.96
N$3
  Top 0.3: R2.1 LED2.C
N$4
  Top 0.3: LED1.C R1.1
N$5
  Top 0.3: R3.1 LED3.C
N$6  (via drill 0.3)
  Top 0.3: R28.2 v77.72,6.35 | v72.14,8.13 72.14,8.48 71.88,8.74 U4.7
  Bottom 0.3: v77.72,6.35 75.44,8.64 72.64,8.64 v72.14,8.13
N$7
  Top 0.3: R9.1 C9.1
N$8
  Top 0.3: R10.1 72.22,69.94 72.39,70.1 72.39,72.9 71.84,73.45 C13.1 | 57.91,75.34 58.27,75.34 58.71,74.89 U3.8 | 57.91,75.34 56.15,75.34 R12.2 | 70.87,73.48 C13.1 | C15.2 68.7,73.45 C13.1 | C13.1 70.9,74.9 70.1,75.69 R13.1 69.94,76.36 68.6,77.7 59.7,77.7 57.91,75.91 57.91,75.34
N$11
  Top 0.3: 59.36,76.28 59.33,76.25 | C15.1 66,73.2 64.95,74.25 C14.1 64.95,76.53 64.52,76.96 60.05,76.96 59.89,76.81 59.36,76.28 | U3.7 59.36,76.28
N$12
  Top 0.3: C3.1 54.5,61.2 53.85,60.55 R8.1
N$13  (via drill 0.3)
  Top 0.3: U4.56 65.79,15.74 v65.53,16 | v61.98,17.78 60.17,17.78 C20.1
  Bottom 0.3: v65.53,16 63.75,17.78 v61.98,17.78
N$14
  Top 0.3: U3.3 61.96,73.79 R14.1
N$15
  Top 0.3: C14.2 R13.2
N$16
  Top 0.3: R16.2 LED4.A
N$17
  Top 0.3: 67.56,70.36 R11.1 67.56,70.87 68.07,71.37 69.55,71.37 69.95,71.78 70.87,71.78 C13.2
N$18
  Top 1: Q3.D 27.43,19.13 26.4,18.1 14.65,18.1 U$4.P2
N$19
  Top 0.3: U5.P5 36.39,24.32 36.32,24.38 35.81,24.38 35.56,24.13 35.56,23.37 R15.2
N$20
  Top 1: C24.1 C22.1 11.8,15.24 | JP7.1A 13.7,2.9 JP7.1B 11.8,9.16 11.8,15.24 | 11.8,15.24 C25.1 6.97,17.27 U$4.S1
N$21
  Top 0.3: R17.1 LED5.C
N$23
  Top 0.3: R15.1 26.16,23.37 24.89,22.61 Q3.G
N$24  (via drill 0.3)
  Top 0.3: U6.13 87.6,76.8 v86.8,77.6
  Bottom 0.3: C27.1 86.4,77.2 v86.8,77.6
N$25  (via drill 0.3)
  Top 0.3: C29.1 96.27,73.82 v96.27,75.18 | U6.12 88.25,77.46 v87.94,77.78
  Bottom 0.3: v96.27,75.18 94.75,76.7 89.01,76.7 v87.94,77.78
N$26  (via drill 0.3)
  Top 0.3: 88.9,75.69 U6.11 88.9,77.57 v89.15,77.83 | v97.54,75.18 97.54,74.93 98.04,74.42 98.04,73.79 C28.1
  Bottom 0.3: v97.54,75.18 95.42,77.3 89.68,77.3 v89.15,77.83
N$27  (via drill 0.3)
  Top 0.3: U7.13 87.6,64.55 v86.87,65.28
  Bottom 0.3: v86.87,65.28 85.34,65.28 85.09,65.53 85.09,66.56 C30.1
N$28  (via drill 0.3)
  Top 0.3: U7.12 88.25,64.91 v88.04,65.23 | C32.1 96.27,61.88 v96.27,63.5
  Bottom 0.3: v88.04,65.23 89.26,64 95.77,64 v96.27,63.5
N$29  (via drill 0.3)
  Top 0.3: U7.11 88.9,65.28 v89.41,65.73 | v97.54,63.5 97.54,63.25 98.04,62.74 98.04,61.91 C31.1
  Bottom 0.3: v89.41,65.73 90.54,64.6 96.44,64.6 v97.54,63.5
N$30  (via drill 0.3)
  Top 0.3: U8.13 87.6,51.59 v86.87,52.32
  Bottom 0.3: v86.87,52.32 83.82,52.32 83.75,52.39 C33.1
N$31  (via drill 0.3)
  Top 0.3: C35.1 96.3,52.04 v96.27,52.07 | U8.12 88.25,52.47 v87.88,52.83
  Bottom 0.3: v87.88,52.83 87.88,52.07 89.41,50.55 94.23,50.55 94.49,50.8 94.49,51.82 94.74,52.07 v96.27,52.07
N$32  (via drill 0.3)
  Top 0.3: v97.54,52.07 97.54,51.82 98.04,51.31 98.04,50.71 C34.1 | U8.11 88.9,52.58 v89.15,52.83
  Bottom 0.3: v89.15,52.83 89.15,51.56 89.66,51.05 93.73,51.05 93.98,51.31 93.98,52.32 94.49,52.83 97.03,52.83 97.54,52.32 v97.54,52.07
N$33  (via drill 0.3)
  Top 0.3: U9.13 87.6,38.64 v86.61,39.62
  Bottom 0.3: C36.1 | C36.1 85.75,40.49 v86.61,39.62
N$34  (via drill 0.3)
  Top 0.3: C38.1 96.3,37.81 v96.27,37.85 | U9.12 88.25,39.26 v87.88,39.62
  Bottom 0.3: v96.27,37.85 95.61,38.5 89.01,38.5 v87.88,39.62
N$35  (via drill 0.3)
  Top 0.3: C37.1 98.04,35.91 98.04,37.34 v97.54,37.85 | U9.11 v88.9,40.13
  Bottom 0.3: v88.9,40.13 89.93,39.1 96.3,39.1 97.44,37.96 v97.54,37.85
NGATE
  Top 0.3: Q1.4 49.82,55.08 48.26,56.64 48.26,60.2 48.77,60.71 48.77,63.5 50.55,65.28 57.66,65.28 58.24,64.7 59.5,64.7 60.01,65.21 U3.11
OUT1+
  Top 0.3: U6.7 93.04,69.93 JP9.P$1
OUT2+
  Top 0.3: 93.2,58.15 JP11.P$1 92.23,57.23 U7.7
OUT2-
  Top 0.3: U7.9 90.2,64.8 90.93,65.53 92.57,65.53 93.2,64.9 JP11.P$2
OUT3+
  Top 0.3: U8.7 92.53,44.53 JP12.P$1
OUT3-
  Top 0.3: U8.9 90.2,51.85 91.19,52.83 92.47,52.83 93.2,52.1 JP12.P$2
OUT4+
  Top 0.3: U9.7 92.23,31.83 JP13.P$1
OUT4-
  Top 0.3: U9.9 90.2,39 91.1,39.9 92.5,39.9 93.2,39.2 JP13.P$2
OUT-
  Top 0.3: U6.9 90.2,76.9 91,77.7 92.1,77.7 93.2,76.6 JP9.P$2
PG
  Top 0.3: R3.2 10.83,55.71 11.43,55.12 15.98,55.12 16.82,55.96 16.82,62.48 16.2,63.1 14.9,63.1 14.2,63.8 14.2,68.8 15.9,70.5 15.9,72 15.5,72.4 U1.7
PGATE  (via drill 0.3)
  Top 0.3: v65.28,58.42 65.28,58.67 61.31,62.64 U3.13 | Q2.4 54.37,45.71 v55.37,44.7
  Bottom 0.3: v55.37,44.7 57.4,44.7 61.47,48.77 61.47,52.83 64.77,56.13 64.77,57.91 v65.28,58.42
PGEC1
  Top 0.3: U4.15 75.89,8.69 76.2,8.38 76.2,7.11 75.69,5.59 68.33,5.59 67.31,4.83 PICKIT3.5
PGED1
  Top 0.3: U4.16 76.39,8.95 76.96,8.38 76.96,6.86 76.2,5.08 69.85,5.08 PICKIT3.4
PIN24
  Top 0.3: JP1.6 61.72,11.94 62.23,11.43 65.28,11.43 66.04,10.67 68.83,10.67 68.89,10.61 U4.1
PIN25
  Top 0.3: JP1.5 59.18,11.43 59.69,10.92 64.77,10.92 67.06,8.64 69.34,8.64 69.39,8.69 U4.2
PIN26
  Top 0.3: JP1.4 56.64,11.8 58.14,10.3 64.5,10.3 66.67,8.13 69.85,8.13 69.89,8.17 U4.3
PIN27
  Top 0.3: U4.4 70.39,7.91 70.1,7.62 66.28,7.62 64.2,9.7 56.7,9.7 54.1,12.3 JP1.3
PIN28
  Top 0.3: JP1.2 51.56,12.45 54.91,9.1 63.9,9.1 65.89,7.11 70.61,7.11 70.89,7.39 U4.5
PIN29
  Top 0.3: JP1.1 49.02,12.95 53.48,8.5 63.6,8.5 65.5,6.6 71.12,6.6 71.37,6.86 71.37,9.72 U4.6
PIN37
  Top 0.3: U4.17 83.26,11.74 83.82,11.18 JP10.6
PIN38
  Top 0.3: U4.18 81.59,12.24 81.79,12.45 86.11,12.45 86.36,12.19 JP10.5
PIN39
  Top 0.3: U4.21 81.31,13.74 82.1,12.95 88.39,12.95 88.9,12.45 JP10.4
PIN40
  Top 0.3: U4.22 81.51,14.24 82.3,13.46 91.19,13.46 91.44,13.21 JP10.3
PIN41
  Top 0.3: U4.23 81.78,14.74 82.55,13.97 93.73,13.97 93.98,13.72 JP10.2
PIN42
  Top 0.3: U4.24 82.04,15.24 82.8,14.48 95.5,14.48 96.52,13.46 JP10.1
PIN43
  Top 0.3: U4.27 82.82,16.74 JP14.6
PIN44
  Top 0.3: U4.28 86.13,17.24 86.36,17.02 JP14.5
PIN45
  Top 0.3: U4.29 88.43,17.74 88.9,17.27 JP14.4
PIN46
  Top 0.3: U4.30 90.98,18.24 91.44,17.78 JP14.3
PROG
  Top 0.3: R4.2 12.7,69.1 14.81,71.21 U1.6
PWMOUT  (via drill 0.3)
  Top 0.3: U4.51 65.58,18.24 v65.53,18.29 | U5.P3 38.35,20.12 38.35,19.05 38.61,18.8 v39.37,18.8 40.13,18.8 40.39,19.05 R27.1
  Bottom 0.3: JP8.2 37.08,16.51 v39.37,18.8 40.67,20.1 63.72,20.1 v65.53,18.29
RIGHT
  Top 0.3: 99.31,60.1 99.31,70.74 C28.2 98.04,72.01 | 99.31,60.1 99.31,49 | 99.31,49 99.31,34.2 | C31.2 98.04,60.09 98.04,60.1 99.31,60.1 | 98.04,48.89 C34.2 98.1,49 99.31,49 | 98.04,34.09 C37.2 98.15,34.2 99.31,34.2 | 99.31,34.2 99.31,32.21 97.48,30.38 JP6.3
SCL0
  Top 0.3: U4.44 70.89,22.63 72.9,25.15 79.76,25.15 81.79,27.18 81.79,36.58 | 81.79,36.58 80.77,35.56 R19.2 | 80.52,54.1 80.52,64.77 83.82,68.07 87.38,68.07 87.6,68.3 U6.2 | 80.52,54.1 80.52,38.61 81.79,37.34 81.79,36.58 | 80.52,54.1 81.28,54.86 87,54.86 87.6,55.46 U7.2
SCL1  (via drill 0.3)
  Top 0.3: U4.32 82.74,19.24 83.31,19.81 v83.31,20.07 v83.31,28.96 | v80.26,30.23 R21.2 | U8.2 87.63,44.5 87.63,43.09 86.7,42.16 82.04,42.16 81.53,41.66 81.53,39.12 82.8,37.85 82.8,34.8 83.82,33.78 83.82,33.27 82.8,32.26 82.8,29.72 83.31,29.21 v83.31,28.96 | U9.2 87.6,29.94 86.61,28.96 v83.31,28.96 | v85.34,19.81 94.69,19.81 96.52,17.98 JP14.1
  Bottom 0.3: v83.31,28.96 81.53,28.96 v80.26,30.23 | v85.34,19.81 83.57,19.81 v83.31,20.07
SDA0  (via drill 0.3)
  Top 0.3: U4.43 71.39,22.52 73.15,24.64 80.01,24.64 82.3,26.92 82.3,33.02 v82.8,33.53 82.3,34.04 82.3,37.59 81.03,38.86 81.03,52.83 81.28,53.09 v81.28,53.59 81.79,53.59 82.55,54.36 87.38,54.36 88.25,55.23 U7.3 | v80.26,32.77 R20.2 | v81.28,55.88 81.03,56.13 81.03,64.52 84.07,67.56 87.63,67.56 88.25,68.18 U6.3
  Bottom 0.3: v82.8,33.53 81.03,33.53 v80.26,32.77 80.52,32.77 | v81.28,55.88 v81.28,53.59
SDA1  (via drill 0.3)
  Top 0.3: v80.26,27.69 R22.2 | U9.3 88.25,29.07 v87.94,29.06 87.63,28.45 84.58,28.45 84.33,28.19 v84.33,26.67 84.33,24.13 84.28,18.8 | v84.58,34.04 83.31,35.56 83.31,38.1 82.04,39.37 82.04,41.15 82.55,41.66 87.2,41.66 88.25,42.71 U8.3 | U4.31 84.28,18.72 84.28,18.8 | JP14.2 93.98,18.26 93.55,18.69 84.38,18.69 84.28,18.8
  Bottom 0.3: v84.33,26.67 81.28,26.67 v80.26,27.69 | v84.58,34.04 85.09,33.27 85.09,31.24 v87.94,29.06
SWITCH+  (via drill 0.3)
  Top 0.3: 53.54,52.27 53.3,52.27 | 53.3,52.27 52.23,52.27 Q1.7 | R8.2 53.85,55.1 | 53.85,55.1 53.85,52.82 53.3,52.27 | R7.2 53.87,55.12 53.85,55.1
  other vias: 51.05,46.48 50.04,46.48 49.02,46.48 52.83,48.51 52.83,47.5 52.83,49.53 51.56,49.53 50.55,49.53 49.53,49.53
  pour Top (isolate 0.3, no thermals): 43.18,52.58 43.18,44.45 46.23,44.45 46.79,43.89 50.8,43.89 50.8,44.2 51.05,44.45 53.34,44.45 53.34,48.41 54.61,48.41 54.61,51.2 52.53,53.16 43.89,53.16
  pour Bottom (isolate 0.3): 43.18,52.83 43.18,43.69 53.34,43.69 53.85,44.2 53.85,53.09 53.59,53.34 43.18,53.34
THERMAL
  Top 0.3: U1.8 15.9,72.9 16.5,72.3 16.5,68.4 R5.2
V+
  Top 0.3: L1.P2 37.64,50.6 39.37,52.32 39.37,52.58 | 57.68,66.27 57.66,66.29 | U3.6 59.99,70.41 | 59.99,70.41 59.94,70.36 | U3.4 61.29,70.43 61.21,70.36 | 60.05,70.36 59.99,70.41 | 57.66,66.55 57.45,66.34 | 57.45,66.34 57.4,66.29 | 19,74.2 16.85,74.2 C2.1 | U3.9 58.71,66.34 57.45,66.34
  Top 0.6: 39.37,52.58 47.75,60.96 47.75,64.26 49.78,66.29 57.4,66.29 57.66,66.29 | 61.29,70.43 61.29,70.03 63.07,68.25 C10.1 | 61.21,70.36 60.05,70.36 | 59.94,70.36 59.44,70.36 57.66,68.58 57.66,66.55
  Top 1: SW1.A2 SW1.A1 20.78,75.98 19,74.2
  pour Top (no thermals): 14.17,73.28 14.17,74.93 17.78,74.93 19.8,74.6 19.8,62.7 24.1,62.7 25.7,61.2 25.7,57.3 24.89,56.39 19.3,56.39 17.5,58.2 17.5,73.3
  pour Top (isolate 0.3, no thermals): 17.5,47.6 21.59,43.69 40.64,43.69 40.64,52.58 25.7,52.58 25.7,58.2 17.5,58.2
V-  (via drill 0.3)
  Top 0.3: U1.5 10.59,71.1 arc45 10.66,70.92 v11.51,70.08 | R4.1 v12.7,64.1 | R5.1 v15.6,64.1
  Top 1: DRV.3 28.43,70.36 SW1.B1 SW1.B2 33.6,69.74 R6.2
  other vias: 5.31,65.48 4.04,65.48 4.04,64.21 5.31,64.21 5.56,67.49 5.59,69.01 12.14,77.44 13.67,76.17 15.19,76.17 15.19,77.44 13.67,77.44 5.84,56.64 7.37,56.64 8.89,56.64 4.32,55.12 5.84,55.12 7.37,55.12 12.14,76.17 10.59,76.17 10.57,77.44 6.15,77.34 6.1,76.23 2.79,55.12 25.07,64.21 26.42,64.19 26.39,65.51 25.07,65.51 26.42,66.75 26.44,68.02 4.95,77.5 3.73,77.52 21.77,68.3 22.78,68.3 23.8,68.3 24.82,68.3 24.82,69.32 23.8,69.32 22.78,69.32 21.77,69.32 25.07,66.78 24.82,70.31 23.8,70.31 22.78,70.31 21.77,70.31 12.14,72.62 13.41,72.62 13.41,71.6 12.14,71.6 12.8,73.61 12.78,74.8
  pour Top (isolate 0.2, no thermals): 5.1,58.5 2.11,58.52 1.45,57.91 1.45,55.32 2.36,54.41 8.08,54.41 9.45,55.78 9.45,56.92 8.5,57.8 5.8,57.8
  pour Top (isolate 0.3, no thermals): 20.78,73.66 20.78,63.75 20.98,63.55 29.24,63.55 29.26,67.79 26.59,69.32 26.64,73.74
  pour Top (isolate 0.2, no thermals): 0,62.74 4.83,62.74 6.32,64.39 6.32,70.64 5.54,71.45 0.15,71.5 0.05,71.4 0.05,62.79
  pour Top (isolate 0.3, rank 2, no thermals): 0,79.25 0,75.44 11.43,75.18 11.43,70.87 14.22,70.87 14.48,71.12 14.38,75.44 19.02,75.44 19.15,75.56 19.15,79.17 19.13,79.71 0.05,79.71
  pour Bottom (isolate 0.3, no thermals): 0,54.33 8.74,54.33 9.63,55.22 14.07,55.22 21.59,62.74 26,62.7 27.94,64.64 27.94,67.82 26.67,69.09 26.67,80.01 0,79.76
VCC  (via drill 0.3)
  Top 0.3: 67.56,58.67 66.55,58.67 62.48,62.74 62.48,64.26 61.96,64.78 U3.14 61.92,67.36 v61.21,68.07 59.94,68.07 59.33,67.46 U3.10 | 67.56,58.67 72.2,58.67 72.2,58.7 71.88,58.7 71.88,52.21 71.24,51.56 | 82.3,58.17 82.55,57.91 83.31,57.91 83.48,57.75 R24.1 83.48,60.29 v82.8,60.96 | 82.55,43.94 R25.1 82.04,43.94 82.04,45.72 v82.8,48.26 | U7.10 89.55,64.91 90.17,65.53 90.17,66.29 | U8.14 85.68,50.47 85.6,50.55 | U7.14 85.42,63.17 85.34,63.25 | U6.14 84.33,75.87 | 84.33,75.87 83.49,75.87 83.31,75.69 82.8,75.69 82.55,75.44 | 82.55,70.27 R23.1 | 84.58,77.98 84.58,77.7 | 84.58,77.7 84.58,76.12 84.33,75.87 | R26.1 85.18,32.6 85.85,33.27 85.85,37.08 v85.34,37.59 85.52,37.77 U9.14 | 48.26,39.62 43.94,35.31 43.94,21.08 40.48,17.62 38.26,17.62 37.34,18.54 | 37.34,18.54 U5.P2 | 36.07,18.54 37.34,18.54 | JP8.3 35.56,19.05 36.07,18.54 | R10.2 R11.2 67.56,58.67 | 36.07,18.54 36.3,18.31 C26.1 | U6.10 89.55,77.15 90.4,78 90.4,78.6 90,79 84.6,79 83.2,77.6 84.48,77.6 84.58,77.7 | U8.10 89.55,51.95 91.1,53.5 | U9.10 89.55,39.75 90.2,40.4 90.2,40.7 89.7,41.2 88.3,41.2 87.8,40.7 85.8,40.7 85.7,40.6 85.7,38 85.3,37.6
  Top 1: 12.8,37.1 13.5,37.8 | U$4.P1 3.16,34.86 6.3,38 12.7,38
  Top 2: PWR.3 PWR.4
  Bottom 0.3: v61.21,68.07 61.21,68.83 | 61.21,68.83 59.52,68.83 59.24,68.55 C12.1 | 61.21,68.83 61.98,68.83 62.6,68.21 62.9,68.4 C11.1
  other vias: 82.8,64.01 84.33,64.01 82.8,62.48 84.33,62.48 84.33,60.96 82.8,51.31 84.33,51.31 82.8,49.78 84.33,49.78 84.33,48.26 74.68,63.75 75.95,63.75 75.95,62.48 74.68,62.48 74.68,61.21 75.95,61.21 74.68,51.05 75.95,51.05 75.95,49.78 74.68,49.78 74.68,48.51 75.95,48.51 84.33,40.13 83.06,40.13 84.07,38.86 85.34,38.86 84.07,37.59 75.95,43.18 74.68,43.18 75.18,42.16 73.91,42.16 73.91,40.89
  pour Top (isolate 0.3, no thermals): 55.37,52.58 71.88,52.58 71.88,68.58 79,75.2 79,79.5 84.9,79.5 84.9,75.2 83.06,75.18 83.06,69.6 81,69.6 76.5,65 76.51,42.42 73.71,39.62 66.8,39.62 63.5,34.8 47.5,34.8 44.2,31.5 22.86,31.24 17.27,35.05 13.97,35.05 11.94,37.08 11.94,41.66 7.62,45.97 7.62,50.04 9.4,51.82 14.73,51.82 16.26,50.29 16.26,47.5 17.27,46.48 21.59,42.42 42.11,42.42 42.93,42.98 51.05,42.98 51.05,40.59 53.54,40.64 53.59,43.03 56.44,42.98 58.42,44.96 58.42,46.23 56.18,46.23 55.37,47.04
  pour Top (isolate 0.3, no thermals): 91.44,67.06 84.33,67.06 81.28,64.52 81.28,57.4 85.34,57.4 85.85,57.91 85.85,65.79 86.11,66.04 91.44,66.04
  pour Top (isolate 0.3, no thermals): 86.87,53.34 91.44,53.34 91.44,54.61 88.39,54.61 87.63,53.85 83.06,53.85 81.53,52.32 81.53,44.96 85.34,44.96 85.85,45.47 85.85,52.32
  pour Bottom (isolate 0.3): 73.91,64.26 84.84,64.26 85.09,64.52 85.09,60.71 84.84,60.45 73.91,60.45
  pour Bottom (isolate 0.3): 85.09,51.82 73.91,51.82 73.91,48.26 74.17,48.01 74.17,47.75 85.09,47.75
  pour Top (isolate 0.3): 86.11,35.56 84.07,35.56 83.82,35.81 83.82,38.35 82.55,39.62 82.55,41.15 87.63,41.15 88.65,42.16 90.42,42.16 91.19,41.4 91.19,40.64 90.42,40.64 90.17,40.39 88.65,40.39 88.14,39.88 86.36,39.88 86.36,35.81
  pour Bottom (isolate 0.3): 85.85,37.08 81.79,37.08 79.76,38.86 73.41,38.86 73.41,44.2 77.22,44.2 77.22,41.66 77.47,41.4 84.07,41.4 85.85,39.62

### Text on the board
tPlace: On/Off | 1 | Prog | Therm | USB PWR | BATTERY | Done | 2 | Chrg | AUX IN | Power | EXT PWR - 5V | 3 | 4 | USBID | L G R | Audio In | 43 | 44 | 45 | 46 | 47 | 48 | PWM | Adj. / Caps | 24 | 25 | 26 | 27 | 28 | 29 | 37 | 38 | 39 | 40 | 41 | 42 | TPad / Output | + | - | USB OUT | Selected / IOIO Pins / Broken out
tNames: Q1 | Q2